# Altium project SAMC21_Xplained_Pro.PrjPCB (part 1 of 2)
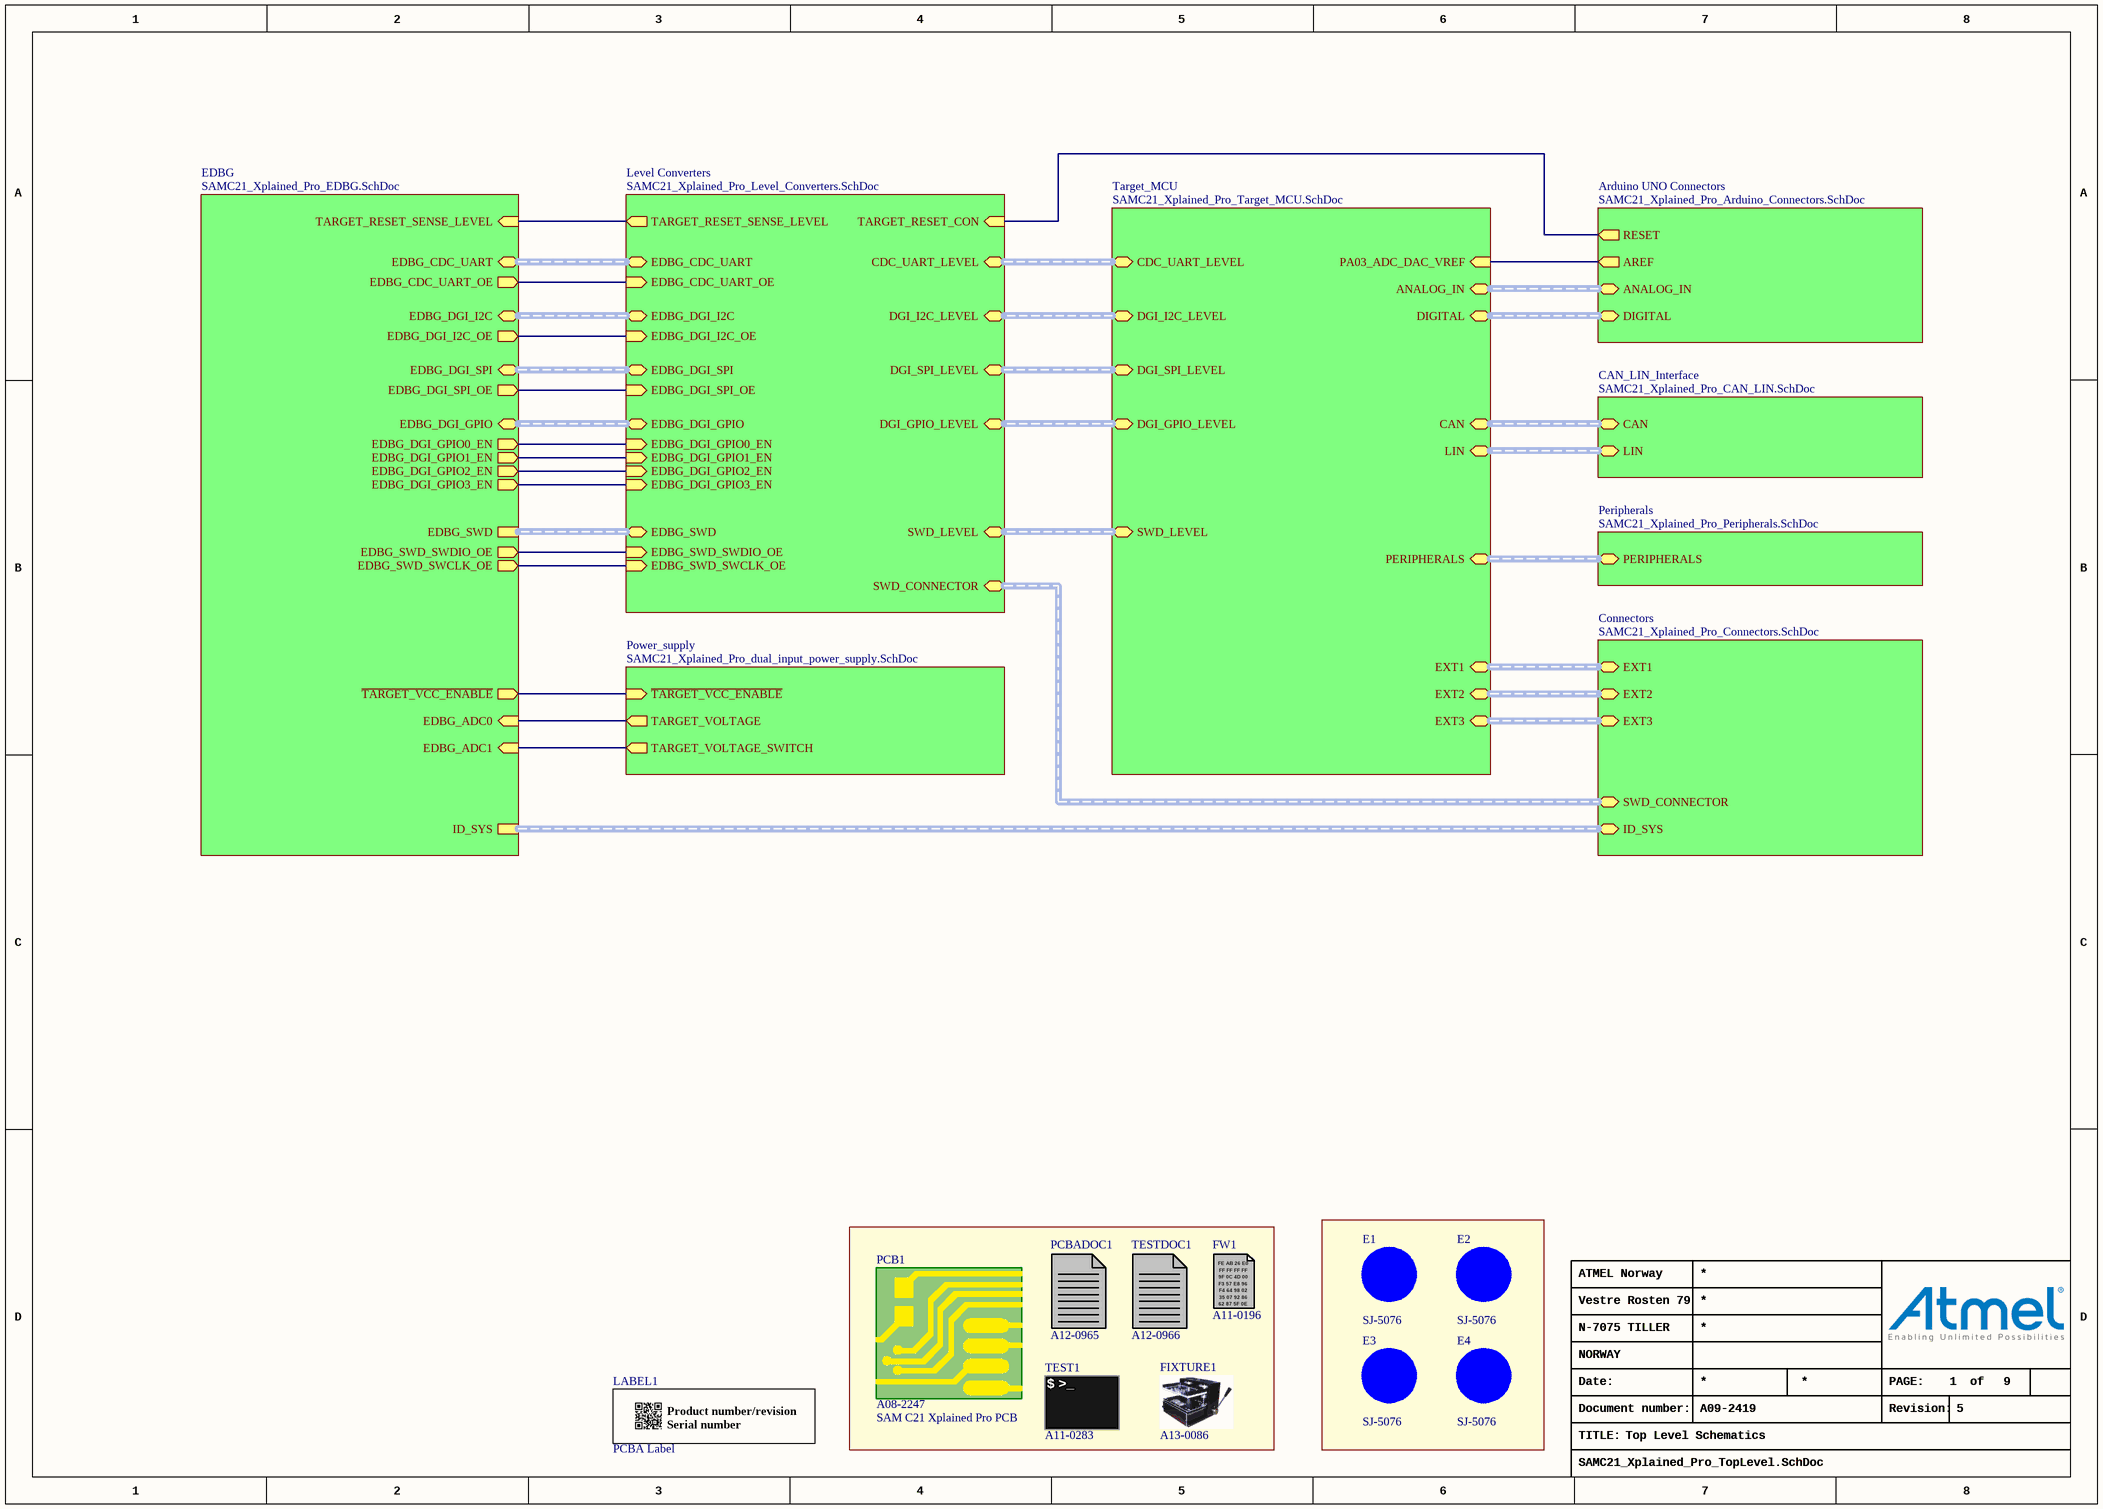
[diagram p0: SAMC21_Xplained_Pro_TopLevel.SchDoc]
9 sheets, 238 parts. Net scope: hierarchical (ports join the sheet entries above them; power ports are global).
Board file: SAMC21_Xplained_Pro.PcbDoc
Sheets:
  SAMC21_Xplained_Pro_TopLevel.SchDoc
    Target_MCU = SAMC21_Xplained_Pro_Target_MCU.SchDoc
    EDBG = SAMC21_Xplained_Pro_EDBG.SchDoc
    Connectors = SAMC21_Xplained_Pro_Connectors.SchDoc
    Power_supply = SAMC21_Xplained_Pro_dual_input_power_supply.SchDoc
    CAN_LIN_Interface = SAMC21_Xplained_Pro_CAN_LIN.SchDoc
    Arduino UNO Connectors = SAMC21_Xplained_Pro_Arduino_Connectors.SchDoc
    Level Converters = SAMC21_Xplained_Pro_Level_Converters.SchDoc
    Peripherals = SAMC21_Xplained_Pro_Peripherals.SchDoc

## Sheet SAMC21_Xplained_Pro_TopLevel.SchDoc: Top Level Schematics
size A3; Organization: ATMEL Norway; Address1: Vestre Rosten 79; Address2: N-7075 TILLER; Address3: NORWAY; DocumentNumber: A09-2419; Revision: 5; SheetNumber: 1; SheetTotal: 9; PageSetup: Record=PageOptions|CenterHorizontal=True|CenterVertical=True|PrintScale=1.01|XCorrection=1.00|YCorrection=1.00|PrintKind=1|BorderSize=5000000|LeftOffset=0|BottomOffset=0|Orientation=2|PaperLength=1000|PaperWidth=1000|Scale=100|PaperSource=7|PrintQuality=-4|MediaType=1|DitherType=10|PaperKind=Letter|PrintScaleMode=1

### Parts
E1  value SJ-5076  [AP8-00192]
E2  value SJ-5076  [AP8-00192]
E3  value SJ-5076  [AP8-00192]
E4  value SJ-5076  [AP8-00192]
FIXTURE1  AN: A13-0086  (mechanical)
FW1  AN: A11-0196  (mechanical)
LABEL1  value PCBA Label  [AP8-00317]
PCB1  value SAM C21 Xplained Pro PCB  AN: A08-2247  (mechanical)
PCBADOC1  AN: A12-0965  (mechanical)
TEST1  AN: A11-0283  (mechanical)
TESTDOC1  AN: A12-0966  (mechanical)

### Sub-sheets
Arduino UNO Connectors = SAMC21_Xplained_Pro_Arduino_Connectors.SchDoc: ANALOG_IN (harness ANALOG_IN), DIGITAL (harness DIGITAL1), RESET (out), AREF (out)
CAN_LIN_Interface = SAMC21_Xplained_Pro_CAN_LIN.SchDoc: CAN (harness CAN), LIN (harness LIN)
Connectors = SAMC21_Xplained_Pro_Connectors.SchDoc: ID_SYS (harness ID_SYS), EXT1 (harness EXT), EXT3 (harness EXT), EXT2 (harness EXT), SWD_CONNECTOR (harness SWD)
EDBG = SAMC21_Xplained_Pro_EDBG.SchDoc: ID_SYS (harness ID_SYS), EDBG_SWD (harness SWD), EDBG_CDC_UART (harness CDC_UART), EDBG_DGI_I2C (harness DGI_I2C), EDBG_DGI_SPI (harness DGI_SPI), EDBG_DGI_GPIO (harness DGI_GPIO), EDBG_ADC0 (in), ~{TARGET_VCC_ENABLE} (out), EDBG_CDC_UART_OE (out), EDBG_SWD_SWDIO_OE (out), EDBG_DGI_I2C_OE (out), EDBG_ADC1 (in), EDBG_SWD_SWCLK_OE (out), EDBG_DGI_SPI_OE (out), TARGET_RESET_SENSE_LEVEL (in), EDBG_DGI_GPIO0_EN (out), EDBG_DGI_GPIO1_EN (out), EDBG_DGI_GPIO2_EN (out), EDBG_DGI_GPIO3_EN (out)
Level Converters = SAMC21_Xplained_Pro_Level_Converters.SchDoc: EDBG_DGI_SPI (harness DGI_SPI), EDBG_DGI_I2C (harness DGI_I2C), EDBG_DGI_GPIO (harness DGI_GPIO), EDBG_CDC_UART (harness CDC_UART), EDBG_SWD (harness SWD), EDBG_SWD_SWDIO_OE (in), EDBG_SWD_SWCLK_OE (in), SWD_LEVEL (harness SWD), DGI_SPI_LEVEL (harness DGI_SPI), DGI_I2C_LEVEL (harness DGI_I2C), DGI_GPIO_LEVEL (harness DGI_GPIO), CDC_UART_LEVEL (harness CDC_UART), TARGET_RESET_SENSE_LEVEL (out), SWD_CONNECTOR (harness SWD), EDBG_DGI_GPIO0_EN (in), EDBG_DGI_GPIO1_EN (in), EDBG_DGI_GPIO2_EN (in), EDBG_DGI_GPIO3_EN (in), EDBG_CDC_UART_OE (in), EDBG_DGI_I2C_OE (in), EDBG_DGI_SPI_OE (in), TARGET_RESET_CON (in)
Peripherals = SAMC21_Xplained_Pro_Peripherals.SchDoc: PERIPHERALS (harness Peripherals)
Power_supply = SAMC21_Xplained_Pro_dual_input_power_supply.SchDoc: TARGET_VOLTAGE (out), ~{TARGET_VCC_ENABLE} (in), TARGET_VOLTAGE_SWITCH (out)
Target_MCU = SAMC21_Xplained_Pro_Target_MCU.SchDoc: SWD_LEVEL (harness SWD), DGI_SPI_LEVEL (harness DGI_SPI), DGI_I2C_LEVEL (harness DGI_I2C), DGI_GPIO_LEVEL (harness DGI_GPIO), CDC_UART_LEVEL (harness CDC_UART), EXT2 (harness EXT), EXT3 (harness EXT), EXT1 (harness EXT), CAN (harness CAN), LIN (harness LIN), DIGITAL (harness DIGITAL1), ANALOG_IN (harness ANALOG_IN), PA03_ADC_DAC_VREF (in), PERIPHERALS (harness Peripherals)

### Nets
EDBG_ADC0: sheet EDBG/EDBG_ADC0, sheet Power_supply/TARGET_VOLTAGE
EDBG_ADC1: sheet EDBG/EDBG_ADC1, sheet Power_supply/TARGET_VOLTAGE_SWITCH
EDBG_CDC_UART_OE: sheet EDBG/EDBG_CDC_UART_OE, sheet Level Converters/EDBG_CDC_UART_OE
EDBG_DGI_GPIO0_EN: sheet EDBG/EDBG_DGI_GPIO0_EN, sheet Level Converters/EDBG_DGI_GPIO0_EN
EDBG_DGI_GPIO1_EN: sheet EDBG/EDBG_DGI_GPIO1_EN, sheet Level Converters/EDBG_DGI_GPIO1_EN
EDBG_DGI_GPIO2_EN: sheet EDBG/EDBG_DGI_GPIO2_EN, sheet Level Converters/EDBG_DGI_GPIO2_EN
EDBG_DGI_GPIO3_EN: sheet EDBG/EDBG_DGI_GPIO3_EN, sheet Level Converters/EDBG_DGI_GPIO3_EN
EDBG_DGI_I2C_OE: sheet EDBG/EDBG_DGI_I2C_OE, sheet Level Converters/EDBG_DGI_I2C_OE
EDBG_DGI_SPI_OE: sheet EDBG/EDBG_DGI_SPI_OE, sheet Level Converters/EDBG_DGI_SPI_OE
EDBG_SWD_SWCLK_OE: sheet EDBG/EDBG_SWD_SWCLK_OE, sheet Level Converters/EDBG_SWD_SWCLK_OE
EDBG_SWD_SWDIO_OE: sheet EDBG/EDBG_SWD_SWDIO_OE, sheet Level Converters/EDBG_SWD_SWDIO_OE
PA03_ADC_DAC_VREF: sheet Target_MCU/PA03_ADC_DAC_VREF, sheet Arduino UNO Connectors/AREF
~{TARGET_VCC_ENABLE}: sheet EDBG/~{TARGET_VCC_ENABLE}, sheet Power_supply/~{TARGET_VCC_ENABLE}
TARGET_RESET_CON: sheet Arduino UNO Connectors/RESET, sheet Level Converters/TARGET_RESET_CON
TARGET_RESET_SENSE_LEVEL: sheet EDBG/TARGET_RESET_SENSE_LEVEL, sheet Level Converters/TARGET_RESET_SENSE_LEVEL

Not connected (* = marked no-connect by the designer): E1 1(FIDUCIAL); E2 1(FIDUCIAL); E3 1(FIDUCIAL); E4 1(FIDUCIAL)

### Buses and harness runs
harness sheet Arduino UNO Connectors/ANALOG_IN = sheet Target_MCU/ANALOG_IN
harness sheet Arduino UNO Connectors/DIGITAL = sheet Target_MCU/DIGITAL
harness sheet CAN_LIN_Interface/CAN = sheet Target_MCU/CAN
harness sheet CAN_LIN_Interface/LIN = sheet Target_MCU/LIN
harness sheet Connectors/EXT1 = sheet Target_MCU/EXT1
harness sheet Connectors/EXT2 = sheet Target_MCU/EXT2
harness sheet Connectors/EXT3 = sheet Target_MCU/EXT3
harness sheet Connectors/ID_SYS = sheet EDBG/ID_SYS
harness sheet Connectors/SWD_CONNECTOR = sheet Level Converters/SWD_CONNECTOR
harness sheet EDBG/EDBG_CDC_UART = sheet Level Converters/EDBG_CDC_UART
harness sheet EDBG/EDBG_DGI_GPIO = sheet Level Converters/EDBG_DGI_GPIO
harness sheet EDBG/EDBG_DGI_I2C = sheet Level Converters/EDBG_DGI_I2C
harness sheet EDBG/EDBG_DGI_SPI = sheet Level Converters/EDBG_DGI_SPI
harness sheet EDBG/EDBG_SWD = sheet Level Converters/EDBG_SWD
harness sheet Level Converters/CDC_UART_LEVEL = sheet Target_MCU/CDC_UART_LEVEL
harness sheet Level Converters/DGI_GPIO_LEVEL = sheet Target_MCU/DGI_GPIO_LEVEL
harness sheet Level Converters/DGI_I2C_LEVEL = sheet Target_MCU/DGI_I2C_LEVEL
harness sheet Level Converters/DGI_SPI_LEVEL = sheet Target_MCU/DGI_SPI_LEVEL
harness sheet Level Converters/SWD_LEVEL = sheet Target_MCU/SWD_LEVEL
harness sheet Peripherals/PERIPHERALS = sheet Target_MCU/PERIPHERALS

### Notes on the sheet
- Date:
- PAGE:
- of
- TITLE:
- Document number:
- Revision:
- (in symbol A09-0611) / Product number/revision / Serial number
- (in symbol A11-0196) FE AB 26 E0; FF FF FF FF; 9F 0C 4D 00; F3 57 E8 96; F4 64 98 02; 35 07 92 86; 62 87 5F 0E
- (in symbol A11-0283) $ >_

### Library data of the parts
E1-E4 = A08-0053: 2.8mm adhesive feet,diam 8.0mm; PartGroup: Mechanical devices,Mounting accessories; Manufacturer: 3M; AN: A08-0053; Height: 2,79999995231628; MPN: SJ-5076
FIXTURE1 = A13-0086: Xplained PRO MCU board Jupiter Test Fixture; PartGroup: Test Equipment,Test Fixtures; Manufacturer: ESCATEC; Value: Xplained PRO MCU board Jupiter Test Fixture; MPN: Xplained PRO MCU board Jupiter Test Fixture
FW1 = A11-0196: EDBG secured firmware; PartGroup: Software,Firmware,Tools; Value: EDBG secured firmware
LABEL1 = A09-0611: PCBA identification label PP Top White Gloss; PartGroup: Mechanical devices,Packaging materials,Printed Labels; Manufacturer: ACT Logimark AS; MPN: 505462; AN: A09-0611
PCB1 = A08-2247: SAM C21 Xplained Pro PCB, 4 layer, 60mm x 100mm; PartGroup: Mechanical devices,Printed circuit boards
PCBADOC1 = A12-0965: SAM C21 Xplained Pro PCBA documentation; PartGroup: Documentation,PCBA Documents,Atmel; Value: A09-2419 PCBA Files
TEST1 = A11-0283: Fixture eggTest for SAM C21 Xplained Pro; PartGroup: Software,Test software,Starter Kit; Value: SAM C21 Xplained Pro test
TESTDOC1 = A12-0966: SAM C21 Xplained Pro Test Instructions; PartGroup: Documentation,Procedures,Test Instructions; Value: SAM C21 Xplained Pro Test Instructions

## Sheet SAMC21_Xplained_Pro_Target_MCU.SchDoc: Target MCU
size A3; Organization: ATMEL Norway; Address1: Vestre Rosten 79; Address2: N-7075 TILLER; Address3: NORWAY; DocumentNumber: A09-2419; Revision: 5; SheetNumber: 4; SheetTotal: 9; PageSetup: Record=PageOptions|CenterHorizontal=True|CenterVertical=True|PrintScale=1.01|XCorrection=1.00|YCorrection=1.00|PrintKind=0|BorderSize=5000000|LeftOffset=0|BottomOffset=0|Orientation=2|PaperLength=1000|PaperWidth=1000|Scale=100|PaperSource=15|PrintQuality=-3|MediaType=1|DitherType=10|PrintScaleMode=1|PaperKind=A3|PaperIndex=8
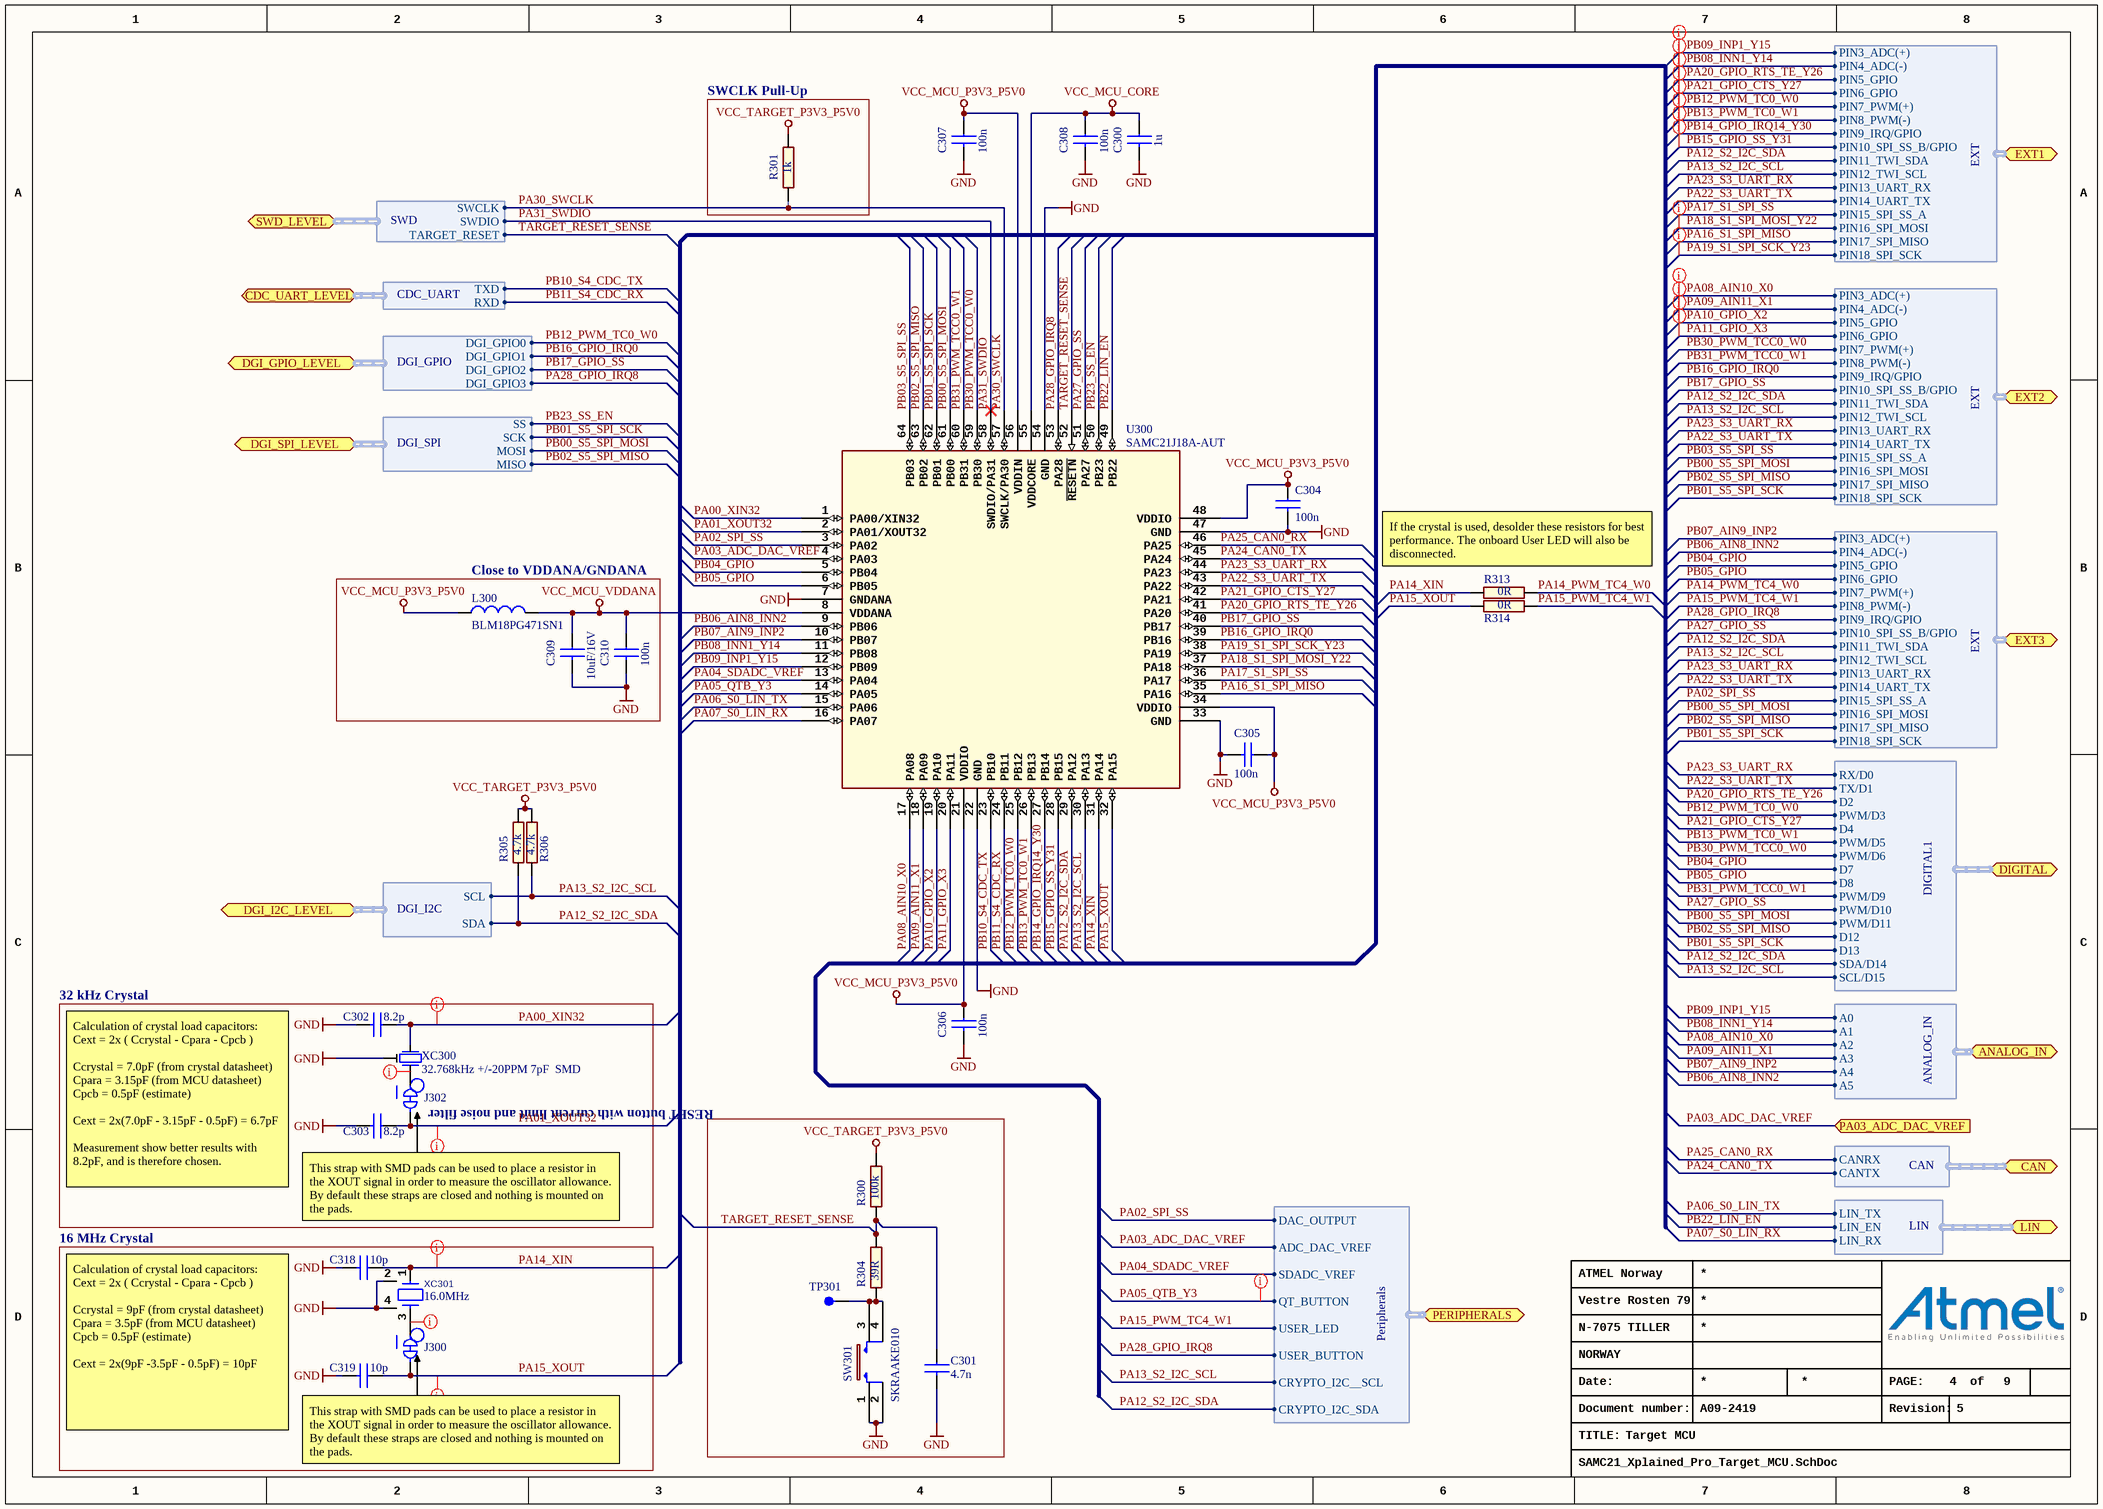
[diagram p1: SAMC21_Xplained_Pro_Target_MCU.SchDoc]

### Parts
C300  value 1u  [AP1-00001]
C301  value 4.7n  [AP1-00001]
C302  value 8.2p  [AP1-00001]
C303  value 8.2p  [AP1-00001]
C304  value 100n  [AP1-00001]
C305  value 100n  [AP1-00001]
C306  value 100n  [AP1-00001]
C307  value 100n  [AP1-00001]
C308  value 100n  [AP1-00001]
C309  value 10uF/16V  [AP1-00039]
C310  value 100n  [AP1-00001]
C318  value 10p  [AP1-00001]
C319  value 10p  [AP1-00001]
J300  (no value)  [AP9-00044]  (net tie, no BOM)
J302  (no value)  [AP9-00044]  (net tie, no BOM)
L300  value BLM18PG471SN1  [AP3-00005]
R300  value 100k  [AP2-00011]
R301  value 1k  [AP2-00000]
R304  value 39R  [AP2-00011]
R305  value 4.7k  [AP2-00000]
R306  value 4.7k  [AP2-00000]
R313  value 0R  [AP2-00000]
R314  value 0R  [AP2-00000]
SW301  value SKRAAKE010  [AP8-00137]  (hidden comment: same as A08-0091 but less force is needed; Can be ordered in low volumes from Mouser)
TP301  (no value)  [AP8-00010]  (no BOM)
U300  value SAMC21J18A-AUT  [AP6-00173]
XC300  value 32.768kHz +/-20PPM 7pF  SMD  [AP7-00044]  (hidden comment: Farnell order no:1539364)
XC301  value 16.0MHz  [AP7-00061]

### Blocks framed on the sheet
SWCLK Pull-Up: R301
Close to VDDANA/GNDANA: C309 C310 L300
32 kHz Crystal: C302 C303 J302 XC300
RESET button with current limit and noise filter: C301 R300 R304 SW301 TP301
16 MHz Crystal: C318 C319 J300 XC301

### Ports
ANALOG_IN (harness ANALOG_IN), CAN (harness CAN), CDC_UART_LEVEL (harness CDC_UART), DGI_GPIO_LEVEL (harness DGI_GPIO), DGI_I2C_LEVEL (harness DGI_I2C), DGI_SPI_LEVEL (harness DGI_SPI), DIGITAL (harness DIGITAL1), EXT1 (harness EXT), EXT2 (harness EXT), EXT3 (harness EXT), LIN (harness LIN), PA03_ADC_DAC_VREF (in), PERIPHERALS (harness Peripherals), SWD_LEVEL (harness SWD)

### Harnesses
SWD: SWCLK, SWDIO, TARGET_RESET
DGI_GPIO: DGI_GPIO0, DGI_GPIO1, DGI_GPIO2, DGI_GPIO3
DGI_SPI: MISO, MOSI, SCK, SS
DGI_I2C: SCL, SDA
CDC_UART: RXD, TXD
EXT: PIN10_SPI_SS_B/GPIO, PIN11_TWI_SDA, PIN12_TWI_SCL, PIN13_UART_RX, PIN14_UART_TX, PIN15_SPI_SS_A, PIN16_SPI_MOSI, PIN17_SPI_MISO, PIN18_SPI_SCK, PIN3_ADC(+), PIN4_ADC(-), PIN5_GPIO, PIN6_GPIO, PIN7_PWM(+), PIN8_PWM(-), PIN9_IRQ/GPIO
DIGITAL1: RX/D0, TX/D1, D2, PWM/D3, D4, PWM/D5, PWM/D6, D7, D8, PWM/D9, PWM/D10, PWM/D11, D12, D13, SDA/D14, SCL/D15
ANALOG_IN: A0, A1, A2, A3, A4, A5
CAN: CANTX, CANRX
LIN: LIN_RX, LIN_EN, LIN_TX
Peripherals: DAC_OUTPUT, ADC_DAC_VREF, SDADC_VREF, QT_BUTTON, USER_LED, USER_BUTTON, CRYPTO_I2C__SCL, CRYPTO_I2C_SDA

### Nets
GND: C300.2 C301.2 C302.2 C303.2 C304.2 C305.2 C306.2 C307.2 C308.2 C309.2 C310.2 C318.2 C319.2 SW301.1 SW301.2 U300.7(GNDANA) U300.22(GND) U300.33(GND) U300.47(GND) U300.54(GND) XC300.3 XC301.2(GND) XC301.4(GND)
VCC_MCU_CORE: C300.1 C308.1 U300.55(VDDCORE)
VCC_MCU_P3V3_P5V0: C304.1 C305.1 C306.1 C307.1 L300.1 U300.21(VDDIO) U300.34(VDDIO) U300.48(VDDIO) U300.56(VDDIN)
VCC_MCU_VDDANA: C309.1 C310.1 L300.2 U300.8(VDDANA)
VCC_TARGET_P3V3_P5V0: R300.2 R301.2 R305.2 R306.2
PA00_XIN32: C302.1 U300.1(PA00/XIN32) XC300.2
PA01_XOUT32: C303.1 J302.2 U300.2(PA01/XOUT32)
PA02_SPI_SS: U300.3(PA02) ; port EXT3.PIN15_SPI_SS_A, port PERIPHERALS.DAC_OUTPUT
PA03_ADC_DAC_VREF: U300.4(PA03) ; port PA03_ADC_DAC_VREF, port PERIPHERALS.ADC_DAC_VREF
PA04_SDADC_VREF: U300.13(PA04) ; port PERIPHERALS.SDADC_VREF
PA05_QTB_Y3: U300.14(PA05) ; port PERIPHERALS.QT_BUTTON
PA06_S0_LIN_TX: U300.15(PA06) ; port LIN.LIN_TX
PA07_S0_LIN_RX: U300.16(PA07) ; port LIN.LIN_RX
PA08_AIN10_X0: U300.17(PA08) ; port EXT2.PIN3_ADC(+), port ANALOG_IN.A2
PA09_AIN11_X1: U300.18(PA09) ; port EXT2.PIN4_ADC(-), port ANALOG_IN.A3
PA10_GPIO_X2: U300.19(PA10) ; port EXT2.PIN5_GPIO
PA11_GPIO_X3: U300.20(PA11) ; port EXT2.PIN6_GPIO
PA12_S2_I2C_SDA: R305.1 U300.29(PA12) ; port DGI_I2C_LEVEL.SDA, port EXT1.PIN11_TWI_SDA, port EXT2.PIN11_TWI_SDA, port EXT3.PIN11_TWI_SDA, port DIGITAL.SDA/D14, port PERIPHERALS.CRYPTO_I2C_SDA
PA13_S2_I2C_SCL: R306.1 U300.30(PA13) ; port DGI_I2C_LEVEL.SCL, port EXT1.PIN12_TWI_SCL, port EXT2.PIN12_TWI_SCL, port EXT3.PIN12_TWI_SCL, port DIGITAL.SCL/D15, port PERIPHERALS.CRYPTO_I2C__SCL
PA14_PWM_TC4_W0: R313.2 ; port EXT3.PIN7_PWM(+)
PA14_XIN: C318.1 R313.1 U300.31(PA14) XC301.1(IN)
PA15_PWM_TC4_W1: R314.2 ; port EXT3.PIN8_PWM(-), port PERIPHERALS.USER_LED
PA15_XOUT: C319.1 J300.2 R314.1 U300.32(PA15)
PA16_S1_SPI_MISO: U300.35(PA16) ; port EXT1.PIN17_SPI_MISO
PA17_S1_SPI_SS: U300.36(PA17) ; port EXT1.PIN15_SPI_SS_A
PA18_S1_SPI_MOSI_Y22: U300.37(PA18) ; port EXT1.PIN16_SPI_MOSI
PA19_S1_SPI_SCK_Y23: U300.38(PA19) ; port EXT1.PIN18_SPI_SCK
PA20_GPIO_RTS_TE_Y26: U300.41(PA20) ; port EXT1.PIN5_GPIO, port DIGITAL.D2
PA21_GPIO_CTS_Y27: U300.42(PA21) ; port EXT1.PIN6_GPIO, port DIGITAL.D4
PA22_S3_UART_TX: U300.43(PA22) ; port EXT1.PIN14_UART_TX, port EXT2.PIN14_UART_TX, port EXT3.PIN14_UART_TX, port DIGITAL.TX/D1
PA23_S3_UART_RX: U300.44(PA23) ; port EXT1.PIN13_UART_RX, port EXT2.PIN13_UART_RX, port EXT3.PIN13_UART_RX, port DIGITAL.RX/D0
PA24_CAN0_TX: U300.45(PA24) ; port CAN.CANTX
PA25_CAN0_RX: U300.46(PA25) ; port CAN.CANRX
PA27_GPIO_SS: U300.51(PA27) ; port EXT3.PIN10_SPI_SS_B/GPIO, port DIGITAL.PWM/D10
PA28_GPIO_IRQ8: U300.53(PA28) ; port DGI_GPIO_LEVEL.DGI_GPIO3, port EXT3.PIN9_IRQ/GPIO, port PERIPHERALS.USER_BUTTON
PA30_SWCLK: R301.1 U300.57(SWCLK/PA30) ; port SWD_LEVEL.SWCLK
PA31_SWDIO: U300.58(SWDIO/PA31) ; port SWD_LEVEL.SWDIO
PB00_S5_SPI_MOSI: U300.61(PB00) ; port DGI_SPI_LEVEL.MOSI, port EXT2.PIN16_SPI_MOSI, port EXT3.PIN16_SPI_MOSI, port DIGITAL.PWM/D11
PB01_S5_SPI_SCK: U300.62(PB01) ; port DGI_SPI_LEVEL.SCK, port EXT2.PIN18_SPI_SCK, port EXT3.PIN18_SPI_SCK, port DIGITAL.D13
PB02_S5_SPI_MISO: U300.63(PB02) ; port DGI_SPI_LEVEL.MISO, port EXT2.PIN17_SPI_MISO, port EXT3.PIN17_SPI_MISO, port DIGITAL.D12
PB03_S5_SPI_SS: U300.64(PB03) ; port EXT2.PIN15_SPI_SS_A
PB04_GPIO: U300.5(PB04) ; port EXT3.PIN5_GPIO, port DIGITAL.D7
PB05_GPIO: U300.6(PB05) ; port EXT3.PIN6_GPIO, port DIGITAL.D8
PB06_AIN8_INN2: U300.9(PB06) ; port EXT3.PIN4_ADC(-), port ANALOG_IN.A5
PB07_AIN9_INP2: U300.10(PB07) ; port EXT3.PIN3_ADC(+), port ANALOG_IN.A4
PB08_INN1_Y14: U300.11(PB08) ; port EXT1.PIN4_ADC(-), port ANALOG_IN.A1
PB09_INP1_Y15: U300.12(PB09) ; port EXT1.PIN3_ADC(+), port ANALOG_IN.A0
PB10_S4_CDC_TX: U300.23(PB10) ; port CDC_UART_LEVEL.TXD
PB11_S4_CDC_RX: U300.24(PB11) ; port CDC_UART_LEVEL.RXD
PB12_PWM_TC0_W0: U300.25(PB12) ; port DGI_GPIO_LEVEL.DGI_GPIO0, port EXT1.PIN7_PWM(+), port DIGITAL.PWM/D3
PB13_PWM_TC0_W1: U300.26(PB13) ; port EXT1.PIN8_PWM(-), port DIGITAL.PWM/D5
PB14_GPIO_IRQ14_Y30: U300.27(PB14) ; port EXT1.PIN9_IRQ/GPIO
PB15_GPIO_SS_Y31: U300.28(PB15) ; port EXT1.PIN10_SPI_SS_B/GPIO
PB16_GPIO_IRQ0: U300.39(PB16) ; port DGI_GPIO_LEVEL.DGI_GPIO1, port EXT2.PIN9_IRQ/GPIO
PB17_GPIO_SS: U300.40(PB17) ; port DGI_GPIO_LEVEL.DGI_GPIO2, port EXT2.PIN10_SPI_SS_B/GPIO
PB22_LIN_EN: U300.49(PB22) ; port LIN.LIN_EN
PB23_SS_EN: U300.50(PB23) ; port DGI_SPI_LEVEL.SS
PB30_PWM_TCC0_W0: U300.59(PB30) ; port EXT2.PIN7_PWM(+), port DIGITAL.PWM/D6
PB31_PWM_TCC0_W1: U300.60(PB31) ; port EXT2.PIN8_PWM(-), port DIGITAL.PWM/D9
TARGET_RESET_SENSE: C301.1 R300.1 R304.2 U300.52(~{RESETN}) ; port SWD_LEVEL.TARGET_RESET
NetJ300_1: J300.1 XC301.3(OUT)
NetJ302_1: J302.1 XC300.1
NetR304_1: R304.1 SW301.3 SW301.4 TP301.1

### Layout directives
rule Assembly Testpoint Usage [Testpoint - Not Allowed    Multiple - Not Allowed]: NetJ300_1, NetJ302_1, PA00_XIN32, PA01_XOUT32, PA14_XIN, PA15_XOUT
net class TOUCH; rule Clearance Constraint [Clearance = 0.6mm]: PA05_QTB_Y3, PA08_AIN10_X0, PA09_AIN11_X1, PA10_GPIO_X2, PA11_GPIO_X3, PA18_S1_SPI_MOSI_Y22, PA19_S1_SPI_SCK_Y23, PA20_GPIO_RTS_TE_Y26, PA21_GPIO_CTS_Y27, PB08_INN1_Y14, PB09_INP1_Y15, PB12_PWM_TC0_W0, PB13_PWM_TC0_W1, PB14_GPIO_IRQ14_Y30, PB15_GPIO_SS_Y31

### Notes on the sheet
- If the crystal is used, desolder these resistors for best performance. The onboard User LED will also be disconnected.
- Calculation of crystal load capacitors:
  Cext = 2x ( Ccrystal - Cpara - Cpcb )
  Ccrystal = 7.0pF (from crystal datasheet)
  Cpara = 3.15pF (from MCU datasheet)
  Cpcb = 0.5pF (estimate)
  Cext = 2x(7.0pF - 3.15pF - 0.5pF) = 6.7pF
  Measurement show better results with 8.2pF, and is therefore chosen.
- This strap with SMD pads can be used to place a resistor in the XOUT signal in order to measure the oscillator allowance.
  By default these straps are closed and nothing is mounted on the pads.
- Calculation of crystal load capacitors:
  Cext = 2x ( Ccrystal - Cpara - Cpcb )
  Ccrystal = 9pF (from crystal datasheet)
  Cpara = 3.5pF (from MCU datasheet)
  Cpcb = 0.5pF (estimate)
  Cext = 2x(9pF -3.5pF - 0.5pF) = 10pF
- Date:
- PAGE:
- of
- TITLE:
- Document number:
- Revision:

### Library data of the parts
C300 = A01-0286: Ceramic capacitor, SMD 0402, X5R, 6.3V, +/-10% (de26942); PartGroup: Capacitors,Ceramic,SMD 0402; Manufacturer: Kemet; MPN: C0402C105K9PAC; TemperatureRange: -55 to 85 deg C; AN: A01-0286; Tolerance: +/-10%; Height: 0,5
C301 = A01-0046: Ceramic capacitor, SMD 0402, X7R, 25V, +/-10% (de35287); PartGroup: Capacitors,Ceramic,SMD 0402; TemperatureRange: -55 - +125 deg C; AN: A01-0046; Tolerance: 25V, +/-10%; Height: 0,550000011920929
C302 C303 = A01-0014: Ceramic capacitor, SMD 0402, NP0, 50V, +/-5%; PartGroup: Capacitors,Ceramic,SMD 0402; TemperatureRange: -55 - +125 deg C; AN: A01-0014; Tolerance: 50V, +/-5%; Height: 0,550000011920929
C304-C308 C310 = A01-0246: Ceramic capacitor, SMD 0402, X7R, 16V, +/-10%; PartGroup: Capacitors,Ceramic,SMD 0402; Manufacturer: Kemet; MPN: C0402C104K4RACTU; TemperatureRange: -55 - +125 deg C; AN: A01-0246; Tolerance: 16V, +/-10%; Height: 0,5
C309 = A01-0491: Ceramic capacitor, SMD 0603, X5R, 16V, 10UF ± 20% (High Density); PartGroup: Capacitors,Ceramic,SMD 0603; Manufacturer: Taiyo Yuden; MPN: EMK107BBJ106MA-T; TemperatureRange: -55°C to +85°C; Tolerance: ­± 20%; AN: A01-0491; Height: 0,819999992847443
C318 C319 = A01-0015: Ceramic capacitor, SMD 0402, NP0, 50V, +/-5%; PartGroup: Capacitors,Ceramic,SMD 0402; TemperatureRange: -55 - +125 deg C; AN: A01-0015; Tolerance: 50V, +/-5%; Height: 0,550000011920929
J300 J302 = A09-0783: Default closed SMD strap, 0603 size; PartGroup: Mechanical devices,PCB implemented components; Value: SMD-STRAP_0603_CLOSED; AN: A09-0783; Height: 0
L300 = A03-0035: SMD RF inductor 0603. Z=470Ohm (@100MHz), Max R(dc)=0.65Ohm, Max current=1A; PartGroup: Inductors,EMI; Manufacturer: Murata; Tolerance: ±25%; TemperatureRange: -55°C to +125°C; AN: A03-0035; Height: 0,800000011920929; MPN: BLM18PG471SN1
R300 = A02-0260: Thick film resistor, SMD 0402, 1/16W, 1%; PartGroup: Resistors,SMD,0402 1%; TemperatureRange: -55ï¿½ to +125ï¿½C; AN: A02-0260; Tolerance: 1 %; Height: 0,349999994039536
R301 = A02-0212: Thick film resistor, SMD 0402, 1/16W, 1%; PartGroup: Resistors,SMD,0402 1%; TemperatureRange: -55 - +125 deg C; AN: A02-0212; Tolerance: 1 %; Height: 0,349999994039536
R304 = A02-0178: Thick film resistor, SMD 0402, 1/16W, 1%; PartGroup: Resistors,SMD,0402 1%; TemperatureRange: -55 - +125 deg C; AN: A02-0178; Tolerance: 1 %; Height: 0,349999994039536
R305 R306 = A02-0228: Thick film resistor, SMD 0402, 1/16W, 1%; PartGroup: Resistors,SMD,0402 1%; TemperatureRange: -55ï¿½ to +125ï¿½C; AN: A02-0228; Tolerance: 1 %; Height: 0,349999994039536
R313 R314 = A02-0163: Thick film resistor, SMD 0402, 1/16W, 1%; PartGroup: Resistors,SMD,0402 1%; Manufacturer: (n/a); MPN: RMCF0402ZT0R00; TemperatureRange: -55 - +125 deg C; AN: A02-0163; Tolerance: 1 %; Height: 0,349999994039536
SW301 = A08-0790: 6.2x6.2 mm SMD tact switch, same as A08-0091 but less force is needed; PartGroup: Mechanical devices,Switches,SMD; Manufacturer: ALPS; TemperatureRange: -30 - +90 deg C; AN: A08-0790; Height: 5,09999990463257; MPN: SKRAAKE010
TP301 = A08-0004: Single SMD testpad; PartGroup: Mechanical devices,Connectors,Test points; AN: A08-0004; Value: TESTPAD; Height: 0
U300 = A06-1192: Atmel 32-bit RISC MCU 64pin; PartGroup: Integrated Circuits,MCU, MPU, DSP,ARM MCU; TemperatureRange: -40Â°C to +105Â°C; Design comment: *; AN: A06-1192; Height: 1,20000004768372; Manufacturer: ATMEL; MPN: SAMC21J18A-AUT
XC300 = A07-0052: 32k768 crystal, +-20ppm, CL=7pF, max ESR 60kOhm, SMD; PartGroup: Frequency devices,Crystals,SMD; Manufacturer: Micro Crystal; MPN: MS1V-T1K 32.768kHz 7pF +/-20PPM TA; Tolerance: +/- 20 PPM; TemperatureRange: -40 /+85; AN: A07-0052; Height: 2,07999992370605
XC301 = A07-0078: 16MHz uXtal, 3.2 x 2.5 mm SMD, CL=9pF, 15PPM, ESR=80ohm(Max.; PartGroup: Frequency devices,Crystals,SMD; Manufacturer: Epson Toyocom; MPN: TSX-3225 16.0000MF09Z-AC3; TemperatureRange: -40Â°C to +85Â°C; AN: A07-0078; Tolerance: 15ppm; Height: 0,699999988079071

## Sheet SAMC21_Xplained_Pro_EDBG.SchDoc: Embedded Debugger (EDBG)
size A3; Organization: ATMEL Norway; Address1: Vestre Rosten 79; Address2: N-7075 TILLER; Address3: NORWAY; DocumentNumber: A09-2419; Revision: 5; SheetNumber: 5; SheetTotal: 9; PageSetup: Record=PageOptions|CenterHorizontal=True|CenterVertical=True|PrintScale=0.71|XCorrection=1.00|YCorrection=1.00|PrintKind=0|BorderSize=5000000|LeftOffset=0|BottomOffset=0|Orientation=2|PaperLength=1000|PaperWidth=1000|Scale=100|PaperSource=15|PrintQuality=600|MediaType=1|DitherType=10|PrintScaleMode=1|PaperKind=A4 (210 x 297 mm)|PaperIndex=9
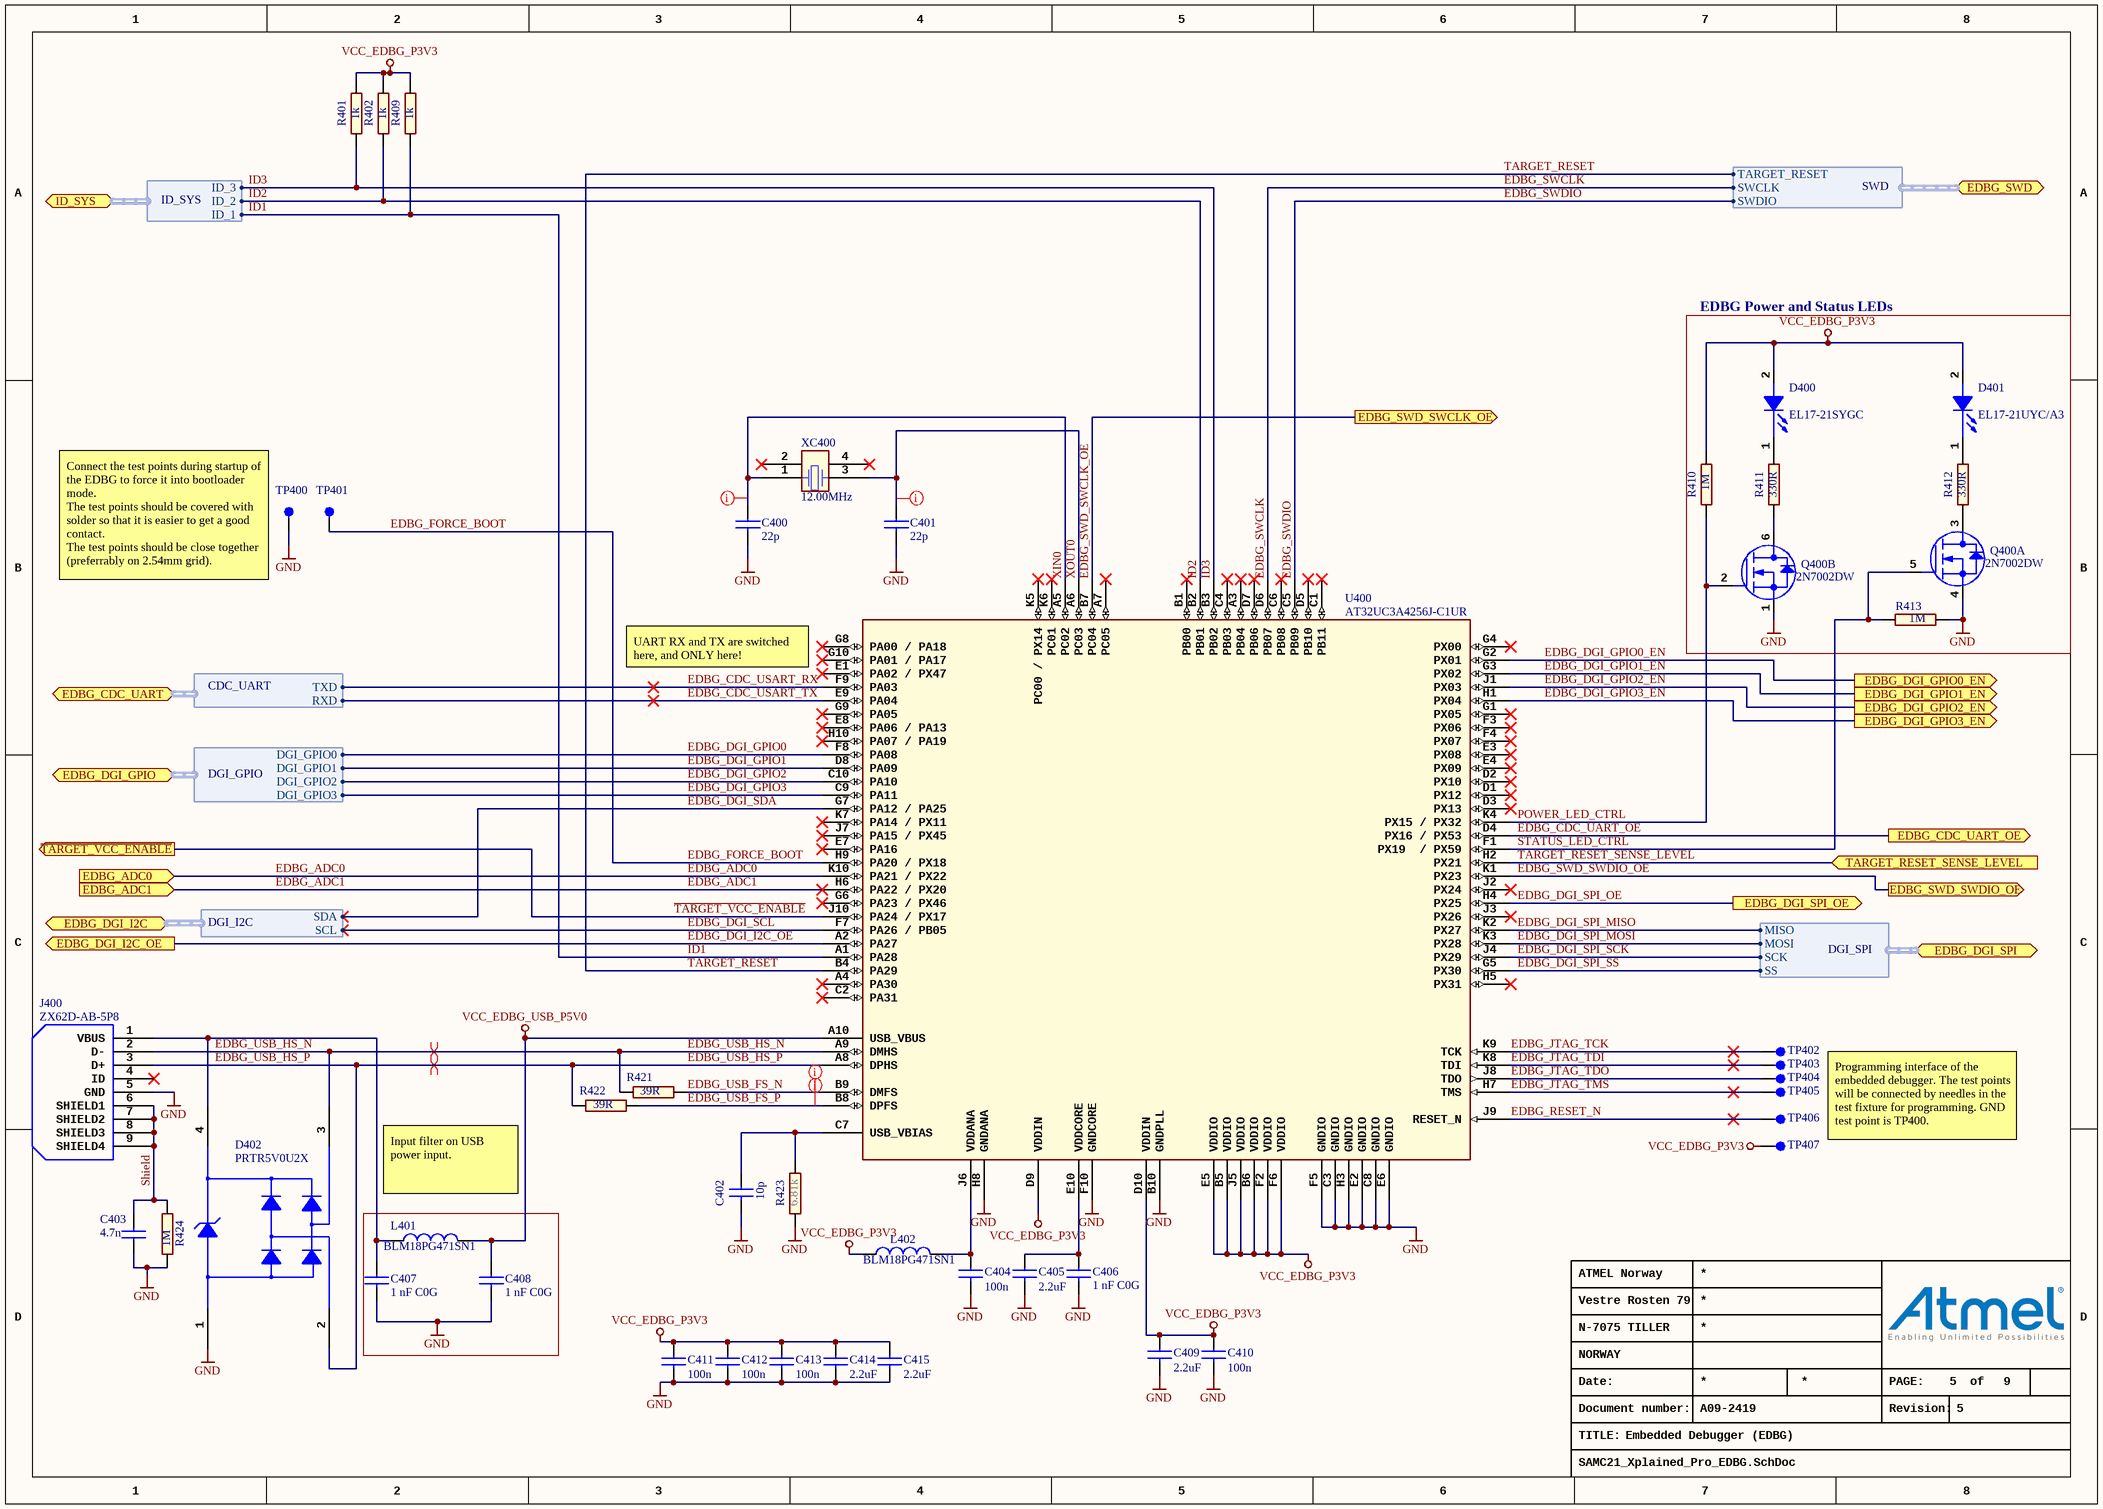
[diagram p2: SAMC21_Xplained_Pro_EDBG.SchDoc]

### Parts
C400  value 22p  [AP1-00053]
C401  value 22p  [AP1-00053]
C402  value 10p  [AP1-00053]
C403  value 4.7n  [AP1-00053]
C404  value 100n  [AP1-00053]
C405  value 2.2uF  [AP1-00053]  (hidden comment: Farnell no: 1288200)
C406  value 1 nF C0G  [AP1-00053]
C407  value 1 nF C0G  [AP1-00053]
C408  value 1 nF C0G  [AP1-00053]
C409  value 2.2uF  [AP1-00053]  (hidden comment: Farnell no: 1288200)
C410  value 100n  [AP1-00053]
C411  value 100n  [AP1-00053]
C412  value 100n  [AP1-00053]
C413  value 100n  [AP1-00053]
C414  value 2.2uF  [AP1-00053]  (hidden comment: Farnell no: 1288200)
C415  value 2.2uF  [AP1-00053]  (hidden comment: Farnell no: 1288200)
D400  value EL17-21SYGC  [AP4-00013]
D401  value EL17-21UYC/A3  [AP4-00013]
D402  value PRTR5V0U2X  [AP4-00001]  (hidden comment: Changed manufacturer from Philips to NXP.)
J400  value ZX62D-AB-5P8  [AP8-00852]  (hidden comment: 2,000 pieces per reel)
L401  value BLM18PG471SN1  [AP3-00005]
L402  value BLM18PG471SN1  [AP3-00005]
Q400  value 2N7002DW  [AP5-00001]  (hidden comment: Same as 2N7002 but with two MOSFETs in one package)  (parts A,B of 2)
R401  value 1k  [AP2-00000]
R402  value 1k  [AP2-00000]
R409  value 1k  [AP2-00000]
R410  value 1M  [AP2-00000]
R411  value 330R  [AP2-00000]
R412  value 330R  [AP2-00000]
R413  value 1M  [AP2-00000]
R421  value 39R  [AP2-00011]
R422  value 39R  [AP2-00011]
R423  value 6.81k  [AP2-00011]
R424  value 1M  [AP2-00011]
TP400  (no value)  [AP8-00010]  (no BOM)
TP401  (no value)  [AP8-00010]  (no BOM)
TP402  (no value)  [AP8-00010]  (no BOM)
TP403  (no value)  [AP8-00010]  (no BOM)
TP404  (no value)  [AP8-00010]  (no BOM)
TP405  (no value)  [AP8-00010]  (no BOM)
TP406  (no value)  [AP8-00010]  (no BOM)
TP407  (no value)  [AP8-00010]  (no BOM)
U400  value AT32UC3A4256J-C1UR  [AP6-00206]  (hidden comment: 100 ball VFBGA)
XC400  value 12.00MHz  [AP7-00039]

### Blocks framed on the sheet
EDBG Power and Status LEDs: D400 D401 Q400 R410-R413

### Ports
EDBG_ADC0 (in), EDBG_ADC1 (in), EDBG_CDC_UART (harness CDC_UART), EDBG_CDC_UART_OE (out), EDBG_DGI_GPIO0_EN (out), EDBG_DGI_GPIO1_EN (out), EDBG_DGI_GPIO2_EN (out), EDBG_DGI_GPIO3_EN (out), EDBG_DGI_GPIO (harness DGI_GPIO), EDBG_DGI_I2C (harness DGI_I2C), EDBG_DGI_I2C_OE (out), EDBG_DGI_SPI (harness DGI_SPI), EDBG_DGI_SPI_OE (out), EDBG_SWD (harness SWD), EDBG_SWD_SWCLK_OE (out), EDBG_SWD_SWDIO_OE (out), ID_SYS (harness ID_SYS), TARGET_RESET_SENSE_LEVEL (in), ~{TARGET_VCC_ENABLE} (out)

### Harnesses
CDC_UART: TXD, RXD
DGI_SPI: MISO, MOSI, SCK, SS
DGI_GPIO: DGI_GPIO0, DGI_GPIO1, DGI_GPIO2, DGI_GPIO3
ID_SYS: ID_1, ID_2, ID_3
SWD: SWCLK, SWDIO, TARGET_RESET
DGI_I2C: SCL, SDA

### Nets
GND: C400.2 C401.2 C402.2 C403.1 C404.2 C405.2 C406.2 C407.2 C408.2 C409.2 C410.2 C411.2 C412.2 C413.2 C414.2 C415.2 D402.1(GND) J400.5(GND) Q400.1(S2) Q400.4(S1) R413.1 R423.1 R424.1 TP400.1 U400.B10(GNDPLL) U400.C3(GNDIO) U400.C8(GNDIO) U400.E2(GNDIO) U400.E6(GNDIO) U400.F5(GNDIO) U400.F10(GNDCORE) U400.H3(GNDIO) U400.H8(GNDANA)
VCC_EDBG_P3V3: C409.1 C410.1 C411.1 C412.1 C413.1 C414.1 C415.1 D400.2(ANODE) D401.2(ANODE) L402.1 R401.2 R402.2 R409.2 R410.2 TP407.1 U400.B5(VDDIO) U400.B6(VDDIO) U400.D9(VDDIN) U400.D10(VDDIN) U400.E5(VDDIO) U400.F2(VDDIO) U400.F6(VDDIO) U400.J5(VDDIO)
VCC_EDBG_USB_P5V0: C408.1 L401.2 U400.A10(USB_VBUS)
EDBG_ADC0: U400.K10(PA21_/_PX22) ; port EDBG_ADC0
EDBG_ADC1: U400.H6(PA22_/_PX20) ; port EDBG_ADC1
EDBG_CDC_UART_OE: U400.D4(PX16_/_PX53) ; port EDBG_CDC_UART_OE
EDBG_CDC_USART_RX: U400.F9(PA03) ; port EDBG_CDC_UART.TXD  [project net EDBG_CDC_UART_TX]
EDBG_CDC_USART_TX: U400.E9(PA04) ; port EDBG_CDC_UART.RXD  [project net EDBG_CDC_UART_RX]
EDBG_DGI_GPIO0: U400.F8(PA08) ; port EDBG_DGI_GPIO.DGI_GPIO0
EDBG_DGI_GPIO0_EN: U400.G2(PX01) ; port EDBG_DGI_GPIO0_EN
EDBG_DGI_GPIO1: U400.D8(PA09) ; port EDBG_DGI_GPIO.DGI_GPIO1
EDBG_DGI_GPIO1_EN: U400.G3(PX02) ; port EDBG_DGI_GPIO1_EN
EDBG_DGI_GPIO2: U400.C10(PA10) ; port EDBG_DGI_GPIO.DGI_GPIO2
EDBG_DGI_GPIO2_EN: U400.J1(PX03) ; port EDBG_DGI_GPIO2_EN
EDBG_DGI_GPIO3: U400.C9(PA11) ; port EDBG_DGI_GPIO.DGI_GPIO3
EDBG_DGI_GPIO3_EN: U400.H1(PX04) ; port EDBG_DGI_GPIO3_EN
EDBG_DGI_I2C_OE: U400.A2(PA27) ; port EDBG_DGI_I2C_OE
EDBG_DGI_SCL: U400.F7(PA26_/_PB05) ; port EDBG_DGI_I2C.SCL  [project net EDBG_DGI_I2C_SCL]
EDBG_DGI_SDA: U400.G7(PA12_/_PA25) ; port EDBG_DGI_I2C.SDA  [project net EDBG_DGI_I2C_SDA]
EDBG_DGI_SPI_MISO: U400.K2(PX27) ; port EDBG_DGI_SPI.MISO
EDBG_DGI_SPI_MOSI: U400.K3(PX28) ; port EDBG_DGI_SPI.MOSI
EDBG_DGI_SPI_OE: U400.H4(PX25) ; port EDBG_DGI_SPI_OE
EDBG_DGI_SPI_SCK: U400.J4(PX29) ; port EDBG_DGI_SPI.SCK
EDBG_DGI_SPI_SS: U400.G5(PX30) ; port EDBG_DGI_SPI.SS
EDBG_FORCE_BOOT: TP401.1 U400.H9(PA20_/_PX18)
EDBG_JTAG_TCK: TP402.1 U400.K9(TCK)
EDBG_JTAG_TDI: TP403.1 U400.K8(TDI)
EDBG_JTAG_TDO: TP404.1 U400.J8(TDO)
EDBG_JTAG_TMS: TP405.1 U400.H7(TMS)
EDBG_RESET_N: TP406.1 U400.J9(RESET_N)
EDBG_SWCLK: U400.D6(PB07) ; port EDBG_SWD.SWCLK
EDBG_SWD_SWCLK_OE: U400.B7(PC04) ; port EDBG_SWD_SWCLK_OE
EDBG_SWD_SWDIO_OE: U400.K1(PX23) ; port EDBG_SWD_SWDIO_OE
EDBG_SWDIO: U400.C5(PB09) ; port EDBG_SWD.SWDIO
EDBG_USB_FS_N: R421.2 U400.B9(DMFS)
EDBG_USB_FS_P: R422.2 U400.B8(DPFS)
EDBG_USB_HS_N: D402.3(I/O_2) J400.2(D-) R421.1 U400.A9(DMHS)
EDBG_USB_HS_P: D402.2(I/O_1) J400.3(D+) R422.1 U400.A8(DPHS)
ID1: R409.1 U400.A1(PA28) ; port ID_SYS.ID_1
ID2: R402.1 U400.B2(PB01) ; port ID_SYS.ID_2
ID3: R401.1 U400.B3(PB02) ; port ID_SYS.ID_3
POWER_LED_CTRL: Q400.2(G2) R410.1 U400.K4(PX15_/_PX32)
Shield: C403.2 J400.6(SHIELD1) J400.7(SHIELD2) J400.8(SHIELD3) J400.9(SHIELD4) R424.2
STATUS_LED_CTRL: Q400.5(G1) R413.2 U400.F1(PX19__/_PX59)
~{TARGET_VCC_ENABLE}: U400.J10(PA24_/_PX17) ; port ~{TARGET_VCC_ENABLE}
TARGET_RESET: U400.B4(PA29) ; port EDBG_SWD.TARGET_RESET
TARGET_RESET_SENSE_LEVEL: U400.H2(PX21) ; port TARGET_RESET_SENSE_LEVEL
XIN0: C400.1 U400.A5(PC02) XC400.1
XOUT0: C401.1 U400.A6(PC03) XC400.3
NetC402_1: C402.1 R423.2 U400.C7(USB_VBIAS)
NetC404_1: C404.1 L402.2 U400.J6(VDDANA)
NetC405_1: C405.1 C406.1 U400.E10(VDDCORE)
NetC407_1: C407.1 D402.4(VCC) J400.1(VBUS) L401.1
NetD400_1: D400.1(CATHODE) R411.2
NetD401_1: D401.1(CATHODE) R412.2
NetQ400_3: Q400.3(D1) R412.1
NetQ400_6: Q400.6(D2) R411.1

Not connected (* = marked no-connect by the designer): J400 4(ID)*; U400 A3(PB04)* A4(PA30)* A7(PC05)* B1(PB00)* C1(PB11)* C2(PA31)* C4(PB03)* C6(PB08)* D1(PX12)* D2(PX10)* D3(PX13)* D5(PB10)* D7(PB06)* E1(PA02_/_PX47)* E3(PX08)* E4(PX09)* E7(PA16)* E8(PA06_/_PA13)* F3(PX06)* F4(PX07)* G1(PX05)* G4(PX00)* G6(PA23_/_PX46)* G8(PA00_/_PA18)* G9(PA05)* G10(PA01_/_PA17)* H5(PX31)* H10(PA07_/_PA19)* J2(PX24)* J3(PX26)* J7(PA15_/_PX45)* K5(PC00_/_PX14)* K6(PC01)* K7(PA14_/_PX11)*; XC400 2* 4*

### Layout directives
differential pair; rule Assembly Testpoint Usage [Testpoint - Not Allowed    Multiple - Not Allowed]: EDBG_USB_HS_N, EDBG_USB_HS_P
rule Assembly Testpoint Usage [Testpoint - Not Allowed    Multiple - Not Allowed]: EDBG_USB_FS_N, EDBG_USB_FS_P, XIN0, XOUT0

### Notes on the sheet
- (near TP400) Connect the test points during startup of the EDBG to force it into bootloader mode.
  The test points should be covered with solder so that it is easier to get a good contact.
  The test points should be close together (preferrably on 2.54mm grid).
- UART RX and TX are switched here, and ONLY here!
- Input filter on USB power input.
- Programming interface of the embedded debugger. The test points will be connected by needles in the test fixture for programming. GND test point is TP400.
- Date:
- PAGE:
- of
- TITLE:
- Document number:
- Revision:

### Library data of the parts
C400 C401 = A01-0019: Ceramic capacitor, SMD 0402, NP0, 50V, +/-5%; PartGroup: Capacitors,Ceramic,SMD 0402; TemperatureRange: -55 - +125 deg C; AN: A01-0019; Tolerance: 50V, +/-5%; Height: 0,550000011920929
C402 = A01-0015: as C318 on sheet SAMC21_Xplained_Pro_Target_MCU; AN: A01-0015; Tolerance: 50V, +/-5%; Height: 0,550000011920929
C403 = A01-0046: Ceramic capacitor, SMD 0402, X7R, 25V, +/-10%; PartGroup: Capacitors,Ceramic,SMD 0402; TemperatureRange: -55 - +125 deg C; AN: A01-0046; Tolerance: 25V, +/-10%; Height: 0,550000011920929
C404 C410-C413 = A01-0246: as C304 on sheet SAMC21_Xplained_Pro_Target_MCU; AN: A01-0246; Tolerance: 16V, +/-10%; Height: 0,5
C405 C409 C414 C415 = A01-0300: Ceramic capacitor, SMD 0402, X5R, 6.3V, +/-20%; PartGroup: Capacitors,Ceramic,SMD 0402; Manufacturer: Kemet; MPN: C0402C225M9PAC; Tolerance: Â±20%; TemperatureRange: -55Â°C to +85Â°C; AN: A01-0300; Height: 0,5
C406-C408 = A01-0321: Ceramic capacitor, SMD 0402, C0G, 50V, +/-5%; PartGroup: Capacitors,Ceramic,SMD 0402; Manufacturer: Murata; MPN: GRM1555C1H102JA01D; Tolerance: 5%; AN: A01-0321; Height: 0,550000011920929
D400 = A10-0018: LED, Green, Wave length=575nm, SMD 0805, ±70°; PartGroup: Opto,LEDs,SMD; Manufacturer: Everlight; TemperatureRange: -40 - +85 deg C; AN: A10-0018; Height: 1,10000002384186; MPN: EL17-21SYGC
D401 = A10-0019: LED, Yellow, Wave length=591nm, SMD 0805, ±70°; PartGroup: Opto,LEDs,SMD; Manufacturer: Everlight; MPN: 17-21UYC/S530-A3/TR8; TemperatureRange: -40 to +85 deg C; AN: A10-0019; Height: 1,10000002384186
D402 = A06-0236: Double rail-to-rail USB ESD protection diode; Manufacturer: NXP; PartGroup: Integrated Circuits,Special function,Protection; TemperatureRange: -40 to +85 C; AN: A06-0236; PartType: Buy; Height: 1,10000002384186; MPN: PRTR5V0U2X
J400 = A08-2112: Micro USB AB Connector, Standard SMT + DIP; PartGroup: Mechanical devices,Connectors,USB; Manufacturer: HIROSE; AN: A08-2112; Height: 2,79999995231628; MPN: ZX62D-AB-5P8
L401 L402 = A03-0035: as L300 on sheet SAMC21_Xplained_Pro_Target_MCU; AN: A03-0035; Height: 0,800000011920929; MPN: BLM18PG471SN1
Q400 = A05-0051: Dual N-Channel MOSFET, 60V, 115mA cont,RDS(ON) < 7.5 Ohm @50mA@5V, SOT-363; PartGroup: Transistors,Small signal FET,SMD; Manufacturer: Fairchild; TemperatureRange: -65 to 150 deg C; AN: A05-0051; Height: 1,10000002384186; MPN: 2N7002DW
R401 R402 R409 = A02-0212: as R301 on sheet SAMC21_Xplained_Pro_Target_MCU; AN: A02-0212; Tolerance: 1 %; Height: 0,349999994039536
R410 R413 R424 = A02-0284: Thick film resistor, SMD 0402, 1/16W, 1%; PartGroup: Resistors,SMD,0402 1%; TemperatureRange: -55 - +125 deg C; AN: A02-0284; Tolerance: 1 %; Height: 0,349999994039536
R411 R412 = A02-0200: Thick film resistor, SMD 0402, 1/16W, 1%; PartGroup: Resistors,SMD,0402 1%; TemperatureRange: -55 - +125 deg C; AN: A02-0200; Tolerance: 1 %; Height: 0,349999994039536
R421 R422 = A02-0178: as R304 on sheet SAMC21_Xplained_Pro_Target_MCU; AN: A02-0178; Tolerance: 1 %; Height: 0,349999994039536
R423 = A02-0539: Thick film resistor, SMD 0402, 1/16W, 1%; PartGroup: Resistors,SMD,0402 1%; TemperatureRange: -55 - +125 deg C; AN: A02-0539; Tolerance: 1%; Height: 0,349999994039536
TP400-TP407 = A08-0004: as TP301 on sheet SAMC21_Xplained_Pro_Target_MCU; AN: A08-0004; Value: TESTPAD; Height: 0
U400 = A06-0736: AVR 32-bit RISC MCU; PartGroup: Integrated Circuits,MCU, MPU, DSP,AVR MCU; Manufacturer: ATMEL; TemperatureRange: -40 to +85 deg C; AN: A06-0736; Height: 1; MPN: AT32UC3A4256J-C1UR
XC400 = A07-0042: Fox FQ5032B 12.0MHz SMD crystal 738B-12; PartGroup: Frequency devices,Crystals,SMD; Manufacturer: Fox  Electronics; MPN: FQ5032B-12.000; Tolerance: Â±30ppm; TemperatureRange: 0Â°C ~ 70Â°C; AN: A07-0042; Height: 1,20000004768372

## Sheet SAMC21_Xplained_Pro_Connectors.SchDoc: Extension connectors
size A3; Organization: ATMEL Norway; Address1: Vestre Rosten 79; Address2: N-7075 TILLER; Address3: NORWAY; DocumentNumber: A09-2419; Revision: 5; SheetNumber: 3; SheetTotal: 9; PageSetup: Record=PageOptions|CenterHorizontal=True|CenterVertical=True|PrintScale=1.01|XCorrection=1.00|YCorrection=1.00|PrintKind=1|BorderSize=5000000|LeftOffset=0|BottomOffset=0|Orientation=2|PaperLength=1000|PaperWidth=1000|Scale=100|PaperSource=7|PrintQuality=-4|MediaType=1|DitherType=10|PaperKind=A3 (297 x 420 mm)|PrintScaleMode=1
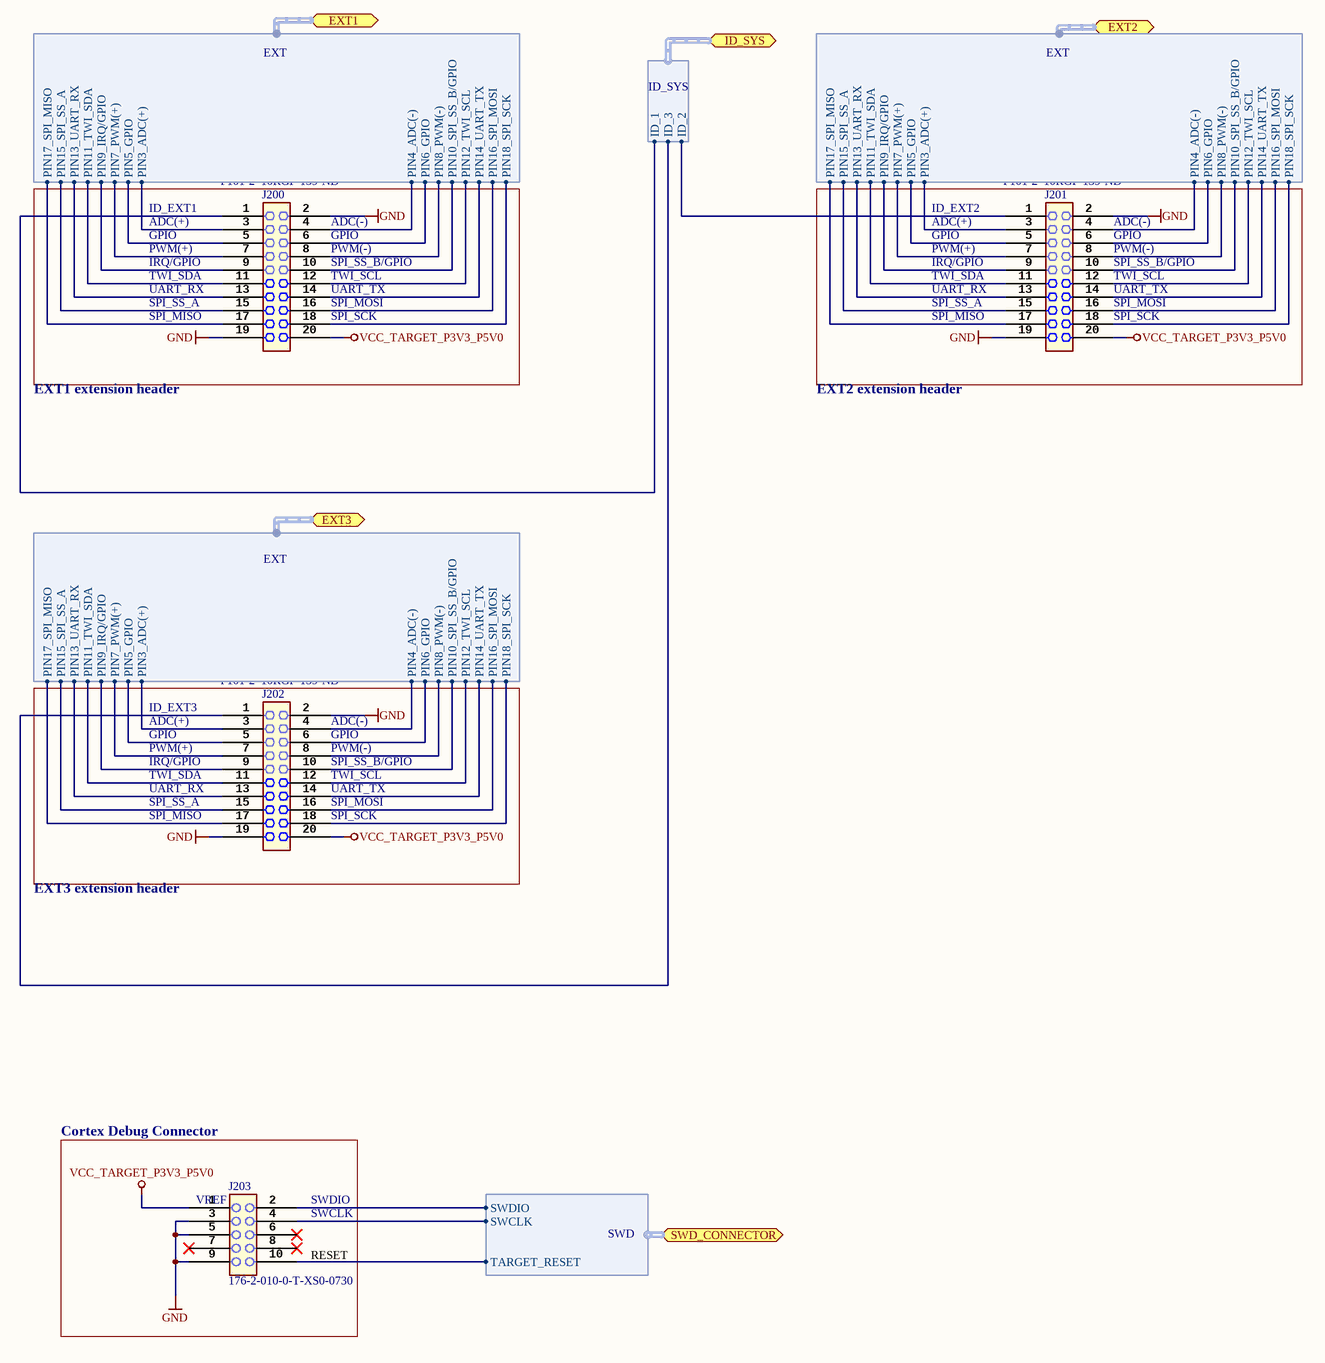
[diagram p3: SAMC21_Xplained_Pro_Connectors.SchDoc]

### Parts
J200  value P101-2*10RGF-139-ND  [AP8-00622]
J201  value P101-2*10RGF-139-ND  [AP8-00622]
J202  value P101-2*10RGF-139-ND  [AP8-00622]
J203  MPN: 176-2-010-0-T-XS0-0730  [AP8-00257]

### Blocks framed on the sheet
Cortex Debug Connector: J203

### Ports
EXT1 (harness EXT), EXT2 (harness EXT), EXT3 (harness EXT), ID_SYS (harness ID_SYS), SWD_CONNECTOR (harness SWD)

### Harnesses
ID_SYS: ID_1, ID_2, ID_3
EXT: PIN3_ADC(+), PIN4_ADC(-), PIN5_GPIO, PIN6_GPIO, PIN7_PWM(+), PIN8_PWM(-), PIN9_IRQ/GPIO, PIN10_SPI_SS_B/GPIO, PIN11_TWI_SDA, PIN12_TWI_SCL, PIN13_UART_RX, PIN14_UART_TX, PIN15_SPI_SS_A, PIN16_SPI_MOSI, PIN17_SPI_MISO, PIN18_SPI_SCK
SWD: SWCLK, SWDIO, TARGET_RESET

### Nets
GND: J200.2 J200.19 J201.2 J201.19 J202.2 J202.19 J203.3 J203.5 J203.9
VCC_TARGET_P3V3_P5V0: J200.20 J201.20 J202.20 J203.1
ID1: J200.1 ; port ID_SYS.ID_1
ID2: J201.1 ; port ID_SYS.ID_2
ID3: J202.1 ; port ID_SYS.ID_3
PA02_SPI_SS: J202.15 ; port EXT3.PIN15_SPI_SS_A
PA08_AIN10_X0: J201.3 ; port EXT2.PIN3_ADC(+)
PA09_AIN11_X1: J201.4 ; port EXT2.PIN4_ADC(-)
PA10_GPIO_X2: J201.5 ; port EXT2.PIN5_GPIO
PA11_GPIO_X3: J201.6 ; port EXT2.PIN6_GPIO
PA12_S2_I2C_SDA: J200.11 J201.11 J202.11 ; port EXT1.PIN11_TWI_SDA, port EXT3.PIN11_TWI_SDA, port EXT2.PIN11_TWI_SDA
PA13_S2_I2C_SCL: J200.12 J201.12 J202.12 ; port EXT1.PIN12_TWI_SCL, port EXT3.PIN12_TWI_SCL, port EXT2.PIN12_TWI_SCL
PA14_PWM_TC4_W0: J202.7 ; port EXT3.PIN7_PWM(+)
PA15_PWM_TC4_W1: J202.8 ; port EXT3.PIN8_PWM(-)
PA16_S1_SPI_MISO: J200.17 ; port EXT1.PIN17_SPI_MISO
PA17_S1_SPI_SS: J200.15 ; port EXT1.PIN15_SPI_SS_A
PA18_S1_SPI_MOSI_Y22: J200.16 ; port EXT1.PIN16_SPI_MOSI
PA19_S1_SPI_SCK_Y23: J200.18 ; port EXT1.PIN18_SPI_SCK
PA20_GPIO_RTS_TE_Y26: J200.5 ; port EXT1.PIN5_GPIO
PA21_GPIO_CTS_Y27: J200.6 ; port EXT1.PIN6_GPIO
PA22_S3_UART_TX: J200.14 J201.14 J202.14 ; port EXT1.PIN14_UART_TX, port EXT3.PIN14_UART_TX, port EXT2.PIN14_UART_TX
PA23_S3_UART_RX: J200.13 J201.13 J202.13 ; port EXT1.PIN13_UART_RX, port EXT3.PIN13_UART_RX, port EXT2.PIN13_UART_RX
PA27_GPIO_SS: J202.10 ; port EXT3.PIN10_SPI_SS_B/GPIO
PA28_GPIO_IRQ8: J202.9 ; port EXT3.PIN9_IRQ/GPIO
PA30_SWCLK: J203.4 ; port SWD_CONNECTOR.SWCLK
PA31_SWDIO: J203.2 ; port SWD_CONNECTOR.SWDIO
PB00_S5_SPI_MOSI: J201.16 J202.16 ; port EXT3.PIN16_SPI_MOSI, port EXT2.PIN16_SPI_MOSI
PB01_S5_SPI_SCK: J201.18 J202.18 ; port EXT3.PIN18_SPI_SCK, port EXT2.PIN18_SPI_SCK
PB02_S5_SPI_MISO: J201.17 J202.17 ; port EXT3.PIN17_SPI_MISO, port EXT2.PIN17_SPI_MISO
PB03_S5_SPI_SS: J201.15 ; port EXT2.PIN15_SPI_SS_A
PB04_GPIO: J202.5 ; port EXT3.PIN5_GPIO
PB05_GPIO: J202.6 ; port EXT3.PIN6_GPIO
PB06_AIN8_INN2: J202.4 ; port EXT3.PIN4_ADC(-)
PB07_AIN9_INP2: J202.3 ; port EXT3.PIN3_ADC(+)
PB08_INN1_Y14: J200.4 ; port EXT1.PIN4_ADC(-)
PB09_INP1_Y15: J200.3 ; port EXT1.PIN3_ADC(+)
PB12_PWM_TC0_W0: J200.7 ; port EXT1.PIN7_PWM(+)
PB13_PWM_TC0_W1: J200.8 ; port EXT1.PIN8_PWM(-)
PB14_GPIO_IRQ14_Y30: J200.9 ; port EXT1.PIN9_IRQ/GPIO
PB15_GPIO_SS_Y31: J200.10 ; port EXT1.PIN10_SPI_SS_B/GPIO
PB16_GPIO_IRQ0: J201.9 ; port EXT2.PIN9_IRQ/GPIO
PB17_GPIO_SS: J201.10 ; port EXT2.PIN10_SPI_SS_B/GPIO
PB30_PWM_TCC0_W0: J201.7 ; port EXT2.PIN7_PWM(+)
PB31_PWM_TCC0_W1: J201.8 ; port EXT2.PIN8_PWM(-)
TARGET_RESET_CON: J203.10 ; port SWD_CONNECTOR.TARGET_RESET

Not connected (* = marked no-connect by the designer): J203 6* 7* 8*

### Notes on the sheet
- ID_EXT1
- ID_EXT2
- ADC(+)
- GPIO
- PWM(+)
- IRQ/GPIO
- TWI_SDA
- UART_RX
- (near J200) ADC(-)
- (near J200) GPIO
- (near J200) PWM(-)
- (near J200) SPI_SS_B/GPIO
- (near J200) TWI_SCL
- (near J200) UART_TX
- (near J201) ADC(-)
- (near J201) GPIO
- (near J201) PWM(-)
- (near J201) SPI_SS_B/GPIO
- (near J201) TWI_SCL
- (near J201) UART_TX
- SPI_SS_A
- SPI_MISO
- (near J200) SPI_MOSI
- (near J200) SPI_SCK
- (near J201) SPI_MOSI
- (near J201) SPI_SCK
- EXT1 extension header
- EXT2 extension header
- ID_EXT3
- (near J202) ADC(-)
- (near J202) GPIO
- (near J202) PWM(-)
- (near J202) SPI_SS_B/GPIO
- (near J202) TWI_SCL
- (near J202) UART_TX
- (near J202) SPI_MOSI
- (near J202) SPI_SCK
- EXT3 extension header
- (near J203) VREF
- SWDIO
- SWCLK
- RESET
- Date:
- PAGE:
- of
- TITLE:
- Document number:
- Revision:

### Library data of the parts
J200-J202 = A08-1513: Pin header, 2x10, Right Angle, 2.54mm, THM, Pin In Paste; PartGroup: Mechanical devices,Connectors,Pin headers; Manufacturer: Pro-data International Corp; AN: A08-1513; MPN: P101-2*10RGF-139-ND
J203 = A08-0385: 2x5 pin header, 1.27mm pitch, THM; PartGroup: Mechanical devices,Connectors,Pin headers; Manufacturer: Garry; Value: PIN HEADER 2x5; AN: A08-0385; Height: 7,30000019073486

## Sheet SAMC21_Xplained_Pro_dual_input_power_supply.SchDoc: Power supply
size A3; Organization: ATMEL Norway; Address1: Vestre Rosten 79; Address2: N-7075 TILLER; Address3: NORWAY; DocumentNumber: A09-2419; Revision: 5; SheetNumber: 2; SheetTotal: 9; PageSetup: Record=PageOptions|CenterHorizontal=True|CenterVertical=True|PrintScale=0.71|XCorrection=1.00|YCorrection=1.00|PrintKind=0|BorderSize=5000000|LeftOffset=0|BottomOffset=0|Orientation=2|PaperLength=1000|PaperWidth=1000|Scale=100|PaperSource=15|PrintQuality=600|MediaType=1|DitherType=10|PrintScaleMode=1|PaperKind=A4 (210 x 297 mm)|PaperIndex=9
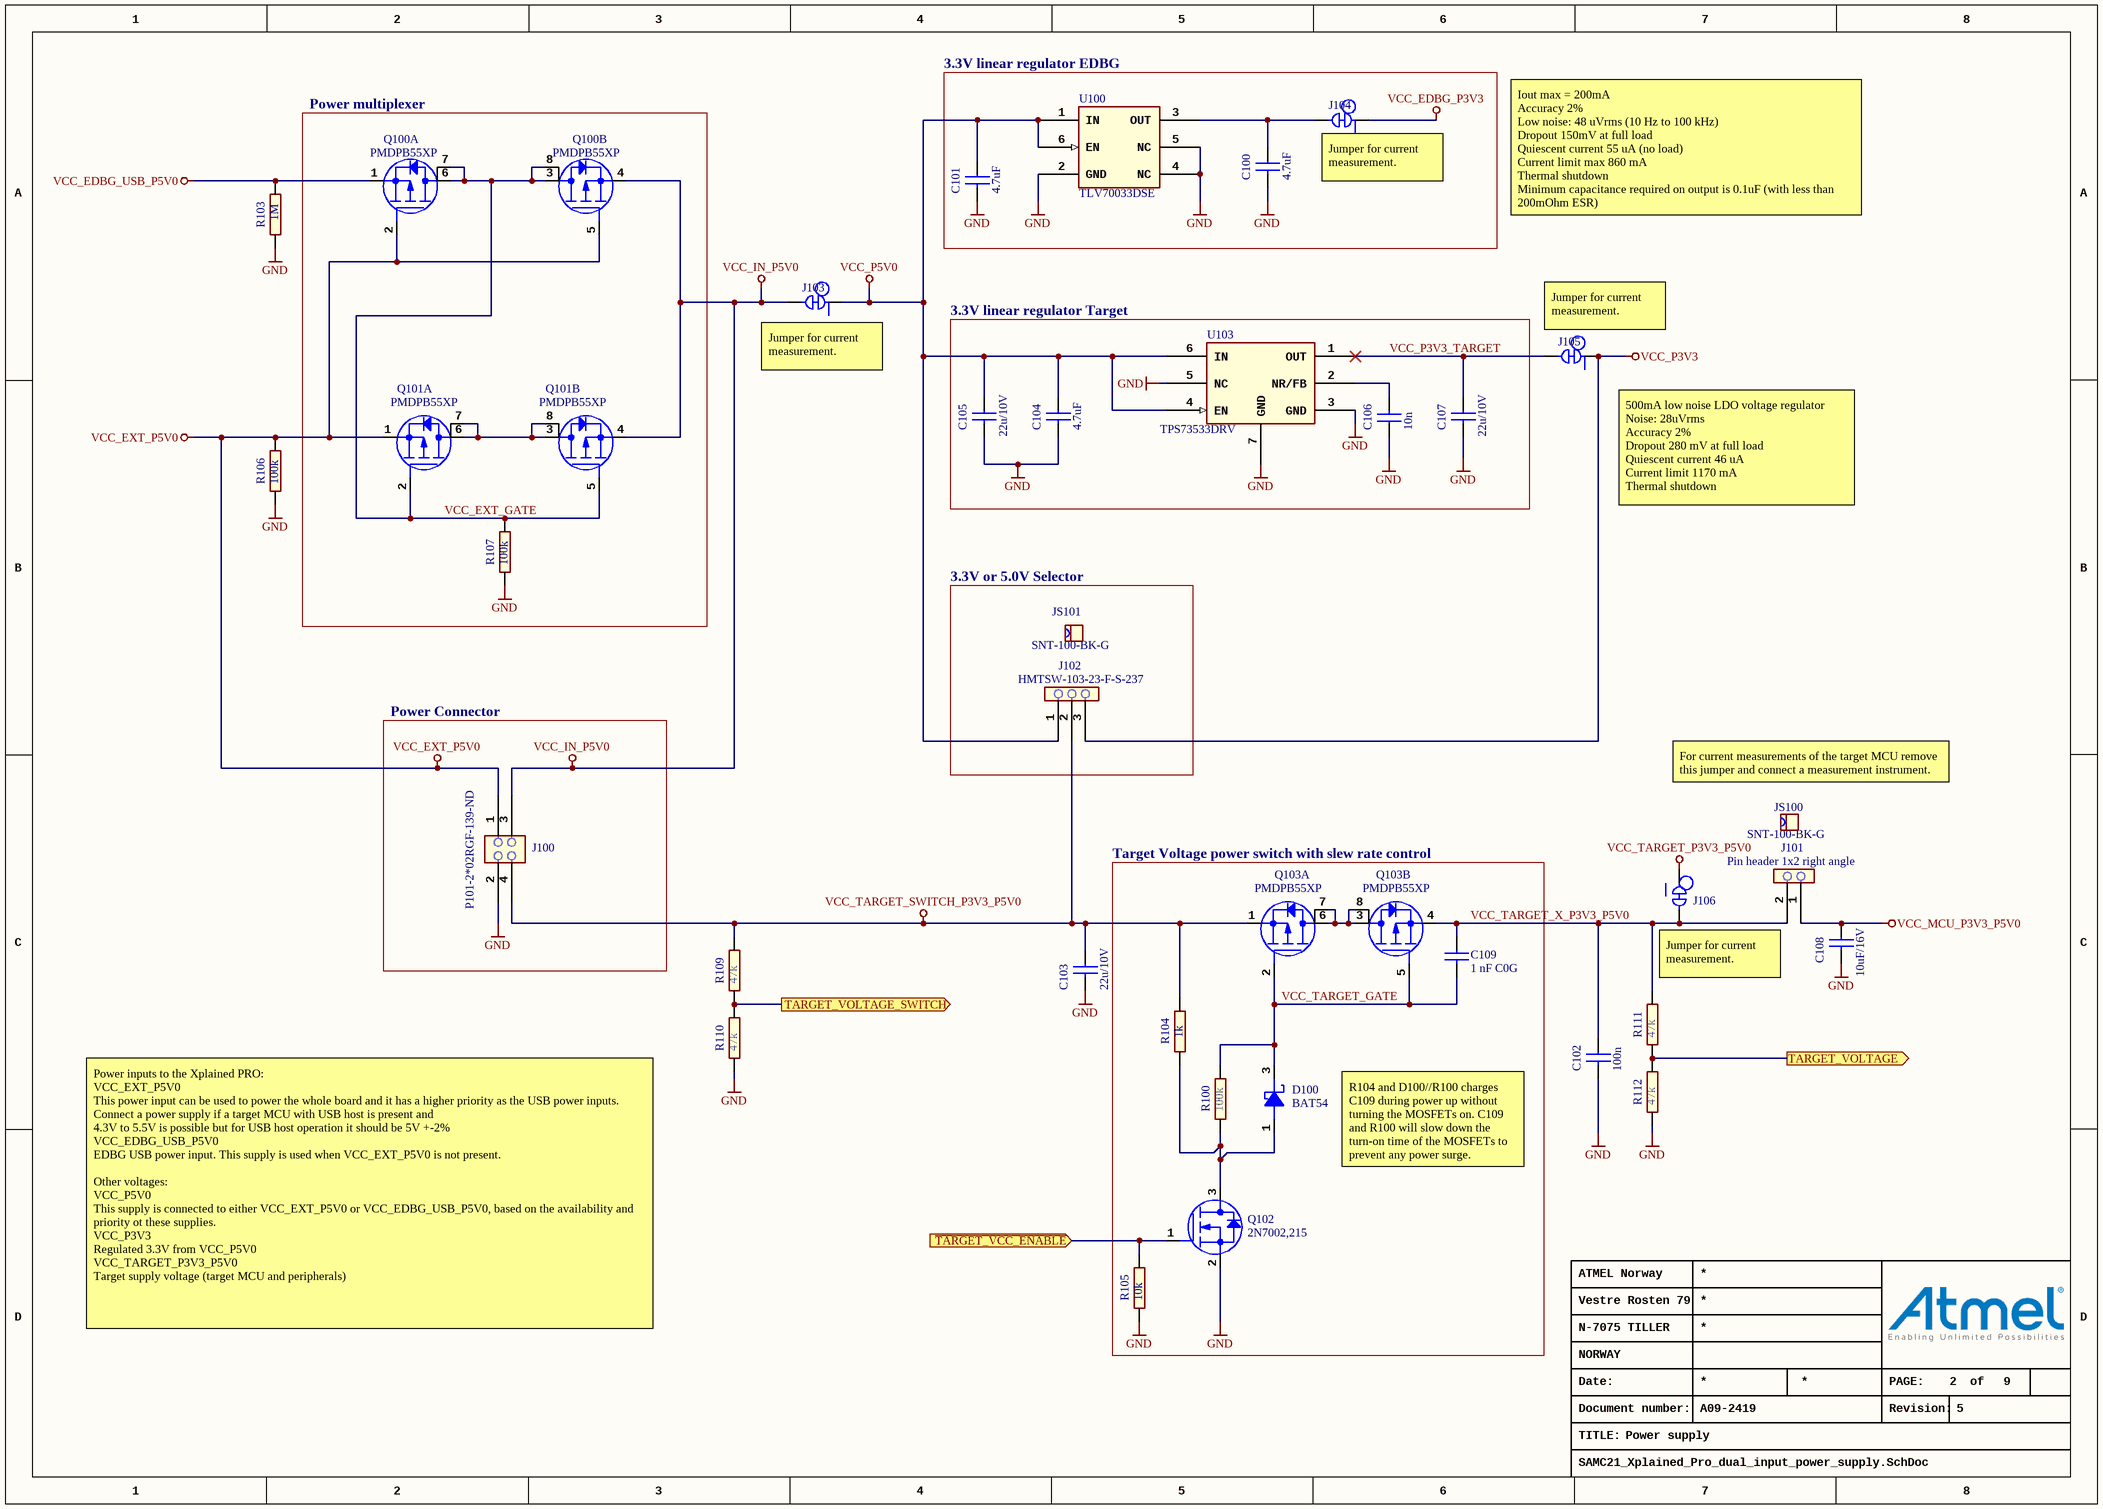
[diagram p4: SAMC21_Xplained_Pro_dual_input_power_supply.SchDoc]

### Parts
C100  value 4.7uF  [AP1-00117]
C101  value 4.7uF  [AP1-00117]
C102  value 100n  [AP1-00001]
C103  value 22u/10V  [AP1-00003]
C104  value 4.7uF  [AP1-00117]
C105  value 22u/10V  [AP1-00003]
C106  value 10n  [AP1-00053]
C107  value 22u/10V  [AP1-00003]
C108  value 10uF/16V  [AP1-00039]
C109  value 1 nF C0G  [AP1-00053]
D100  value BAT54  [AP4-00007]
J100  value P101-2*02RGF-139-ND  [AP8-00628]
J101  value Pin header 1x2 right angle  [AP8-00367]
J102  value HMTSW-103-23-F-S-237  [AP8-00745]
J103  (no value)  [AP9-00044]  (net tie, no BOM)
J104  (no value)  [AP9-00044]  (net tie, no BOM)
J105  (no value)  [AP9-00044]  (net tie, no BOM)
J106  (no value)  [AP9-00044]  (net tie, no BOM)
JS100  value SNT-100-BK-G  [AP8-00525]
JS101  value SNT-100-BK-G  [AP8-00525]
Q100  value PMDPB55XP  [AP5-00047]  (hidden comment: Farnell order code: 2191806)  (parts A,B of 2)
Q101  value PMDPB55XP  [AP5-00047]  (hidden comment: Farnell order code: 2191806)  (parts A,B of 2)
Q102  value 2N7002,215  [AP5-00002]
Q103  value PMDPB55XP  [AP5-00047]  (hidden comment: Farnell order code: 2191806)  (parts A,B of 2)
R100  value 100k  [AP2-00000]
R103  value 1M  [AP2-00000]
R104  value 1k  [AP2-00000]
R105  value 10k  [AP2-00000]
R106  value 100k  [AP2-00000]
R107  value 100k  [AP2-00000]
R109  value 47k  [AP2-00000]
R110  value 47k  [AP2-00000]
R111  value 47k  [AP2-00000]
R112  value 47k  [AP2-00000]
U100  value TLV70033DSE  [AP6-00262]
U103  value TPS73533DRV  [AP6-00162]

### Blocks framed on the sheet
Power multiplexer: Q100 Q101 R107
3.3V linear regulator EDBG: C100 C101 J104 U100
3.3V linear regulator Target: C104-C107 U103
3.3V or 5.0V Selector: J102 JS101
Power Connector: J100
Target Voltage power switch with slew rate control: C109 D100 Q102 Q103 R100 R104 R105

### Ports
TARGET_VOLTAGE (out), TARGET_VOLTAGE_SWITCH (out), ~{TARGET_VCC_ENABLE} (in)

### Nets
GND: C100.2 C101.2 C102.2 C103.2 C104.2 C105.2 C106.1 C107.2 C108.2 J100.2 Q102.2(S) R103.1 R105.1 R106.1 R107.1 R110.1 R112.1 U100.2(GND) U100.4(NC) U100.5(NC) U103.3(GND) U103.5(NC) U103.7(GND)
VCC_EDBG_P3V3: J104.1
VCC_EDBG_USB_P5V0: Q100.1(S1) R103.2
VCC_EXT_P5V0: J100.1 Q100.2(G1) Q100.5(G2) Q101.1(S1) R106.2
VCC_IN_P5V0: J100.3 J103.2 Q100.4(S2) Q101.4(S2)
VCC_MCU_P3V3_P5V0: C108.1 J101.1
VCC_P3V3: J102.3 J105.1
VCC_P5V0: C101.1 C104.1 C105.1 J102.1 J103.1 U100.1(IN) U100.6(EN) U103.4(EN) U103.6(IN)
VCC_TARGET_P3V3_P5V0: J106.1
VCC_TARGET_SWITCH_P3V3_P5V0: C103.1 J100.4 J102.2 Q103.1(S1) R104.2 R109.2
EDBG_ADC0: R111.1 R112.2 ; port TARGET_VOLTAGE
EDBG_ADC1: R109.1 R110.2 ; port TARGET_VOLTAGE_SWITCH
~{TARGET_VCC_ENABLE}: Q102.1(G) R105.2 ; port ~{TARGET_VCC_ENABLE}
VCC_EXT_GATE: Q100.3(D2) Q100.6(D1) Q100.7(D1_PAD) Q100.8(D2_PAD) Q101.2(G1) Q101.5(G2) R107.2
VCC_P3V3_TARGET: C107.1 J105.2 U103.1(OUT)
VCC_TARGET_GATE: C109.2 D100.3(CATHODE) Q103.2(G1) Q103.5(G2) R100.2
VCC_TARGET_X_P3V3_P5V0: C102.1 C109.1 J101.2 J106.2 Q103.4(S2) R111.2
NetC100_1: C100.1 J104.2 U100.3(OUT)
NetC106_2: C106.2 U103.2(NR/FB)
NetD100_1: D100.1(ANODE) Q102.3(D) R100.1 R104.1
NetQ101_3: Q101.3(D2) Q101.6(D1) Q101.7(D1_PAD) Q101.8(D2_PAD)
NetQ103_3: Q103.3(D2) Q103.6(D1) Q103.7(D1_PAD) Q103.8(D2_PAD)

### Notes on the sheet
- (near J104) Jumper for current measurement.
- Iout max = 200mA
  Accuracy 2%
  Low noise: 48 uVrms (10 Hz to 100 kHz)
  Dropout 150mV at full load
  Quiescent current 55 uA (no load)
  Current limit max 860 mA
  Thermal shutdown
  Minimum capacitance required on output is 0.1uF (with less than 200mOhm ESR)
- (near J103) Jumper for current measurement.
- (near J105) Jumper for current measurement.
- (near J105) 500mA low noise LDO voltage regulator
  Noise: 28uVrms
  Accuracy 2%
  Dropout 280 mV at full load
  Quiescent current 46 uA
  Current limit 1170 mA
  Thermal shutdown
- For current measurements of the target MCU remove this jumper and connect a measurement instrument.
- Jumper for current measurement.
- R104 and D100//R100 charges C109 during power up without turning the MOSFETs on. C109 and R100 will slow down the turn-on time of the MOSFETs to prevent any power surge.
- Power inputs to the Xplained PRO:
  VCC_EXT_P5V0
  This power input can be used to power the whole board and it has a higher priority as the USB power inputs. Connect a power supply if a target MCU with USB host is present and
  4.3V to 5.5V is possible but for USB host operation it should be 5V +-2%
  VCC_EDBG_USB_P5V0
  EDBG USB power input. This supply is used when VCC_EXT_P5V0 is not present.
  Other voltages:
  VCC_P5V0
  This supply is connected to either VCC_EXT_P5V0 or VCC_EDBG_USB_P5V0, based on the availability and priority ot these supplies.
  VCC_P3V3
  Regulated 3.3V from VCC_P5V0
  VCC_TARGET_P3V3_P5V0
  Target supply voltage (target MCU and peripherals)
- Date:
- PAGE:
- of
- TITLE:
- Document number:
- Revision:

### Library data of the parts
C100 C101 C104 = A01-0377: Ceramic capacitor, SMD 0603, X5R, 10V, 10% (de31036); PartGroup: Capacitors,Ceramic,SMD 0603; Manufacturer: tdk; MPN: C1608X5R1A475K; TemperatureRange: -55 - +85 deg C; AN: A01-0377; Tolerance: 10%; Height: 0,800000011920929
C102 = A01-0246: as C304 on sheet SAMC21_Xplained_Pro_Target_MCU; AN: A01-0246; Tolerance: 16V, +/-10%; Height: 0,5
C103 C105 C107 = A01-0500: Ceramic capacitor, SMD 0805, X5R, 10V, Â±20%; PartGroup: Capacitors,Ceramic,SMD 0805; Manufacturer: tdk; MPN: C2012X5R1A226M/0.85; TemperatureRange: -55Â°C to +85Â°C; AN: A01-0500; Height: 0,949999988079071
C106 = A01-0050: Ceramic capacitor, SMD 0402, X7R, 25V, +/-10%; PartGroup: Capacitors,Ceramic,SMD 0402; TemperatureRange: -55 - +125 deg C; AN: A01-0050; Tolerance: 25V, +/-10%; Height: 0,550000011920929
C108 = A01-0491: Ceramic capacitor, SMD 0603, X5R, 16V, 10UF ± 20% (High Density); PartGroup: Capacitors,Ceramic,SMD 0603; Manufacturer: Taiyo Yuden; MPN: EMK107BBJ106MA-T; Tolerance: ­± 20%; TemperatureRange: -55°C to +85°C; AN: A01-0491; Height: 0,819999992847443
C109 = A01-0321: as C406 on sheet SAMC21_Xplained_Pro_EDBG; AN: A01-0321; Height: 0,550000011920929
D100 = A04-0001: Schottky diode, V(rrm)=30V, I(f)=0.1A, V(f)=0.4V (at If = 0.01A), I(r)=0.5uA (at Vrrm), t(rr)=5ns, SMD SOT23; PartGroup: Diodes,Schottky; Manufacturer: Philips; NC: 2; TemperatureRange: -40 - +85 deg C; AN: A04-0001; Height: 1,10000002384186; MPN: BAT54
J100 = A08-1519: Pin header, 2x2, Right Angle, 2.54mm, THT, Pin In Paste; PartGroup: Mechanical devices,Connectors,Pin headers; Manufacturer: Pro-data International Corp; AN: A08-1519; Height: 5,07999992370605; MPN: P101-2*02RGF-139-ND
J101 = A08-0764: 1x2 pin header, right angle, 2.54 mm pitch, through-hole; PartGroup: Mechanical devices,Connectors,Pin headers; Manufacturer: Pro-data International Corp; MPN: 2213R-2G; AN: A08-0764; Height: 2,53999996185303
J102 = A08-1799: 1x3 pin header, 2.54mm pitch, Pin-in-Paste THM, 1mm hole; PartGroup: Mechanical devices,Connectors,Pin headers; Manufacturer: SAMTEC; AN: A08-1799; Height: 6,09999990463257; MPN: HMTSW-103-23-F-S-237
J103-J106 = A09-0783: as J300 on sheet SAMC21_Xplained_Pro_Target_MCU; AN: A09-0783; Height: 0
JS100 JS101 = A08-0543: Jumper cap for 2.54mm pinheader; PartGroup: Mechanical devices,Mounting accessories,Other; Manufacturer: SAMTEC; AN: A08-0543; MPN: SNT-100-BK-G
Q100 Q101 Q103 = A05-0146: Dual P-Channel MOSFET, -20V, RDS(ON) < 55 mOhm @-3.4A@-4.5V; PartGroup: Transistors,Power FET,SMD; Manufacturer: NXP; TemperatureRange: -55Â°C to 150Â°C; AN: A05-0146; Height: 0,649999976158142; MPN: PMDPB55XP
Q102 = A05-0085: N-Channel MOSFET. 60V, 0.300A continuous, 1.2A Peak. RDS(ON) = 3.8Ohm@VGS=4.5V, VGS(th)<2.5V; PartGroup: Transistors,Small signal FET,SMD; Manufacturer: NXP; TemperatureRange: -65 to 150 deg C; AN: A05-0085; Height: 1,10000002384186; MPN: 2N7002,215
R100 R106 R107 = A02-0260: as R300 on sheet SAMC21_Xplained_Pro_Target_MCU; AN: A02-0260; Tolerance: 1 %; Height: 0,349999994039536
R103 = A02-0284: as R410 on sheet SAMC21_Xplained_Pro_EDBG; AN: A02-0284; Tolerance: 1 %; Height: 0,349999994039536
R104 = A02-0212: as R301 on sheet SAMC21_Xplained_Pro_Target_MCU; AN: A02-0212; Tolerance: 1 %; Height: 0,349999994039536
R105 = A02-0236: Thick film resistor, SMD 0402, 1/16W, 1%; PartGroup: Resistors,SMD,0402 1%; Manufacturer: vishay; MPN: CRCW040210K0FKED; TemperatureRange: -55 - +125 deg C; AN: A02-0236; Tolerance: 1 %; Height: 0,349999994039536
R109-R112 = A02-0252: Thick film resistor, SMD 0402, 1/16W, 1%; PartGroup: Resistors,SMD,0402 1%; TemperatureRange: -55 - +125 deg C; AN: A02-0252; Tolerance: 1 %; Height: 0,349999994039536
U100 = A06-0719: LDO, 200 mA, Iq=31 uA, Vdo=250mV, Vout=3.3V, VIN= 2 V to 5.5V, SON-6 package; PartGroup: Integrated Circuits,Regulators,Linear; Manufacturer: Texas Instruments; AN: A06-0719; Height: 0,800000011920929; MPN: TLV70033DSE
U103 = A06-1135: Low noise LDO, 500 mA, Vout=3.3V, 2% accuracy, IQ=46uA, noise=28uVrms, VIN= 2.7V to 6.5V, Vdo=280mV,stable with low ESR capacitor; PartGroup: Integrated Circuits,Regulators,Linear; Manufacturer: Texas Instruments; AN: A06-1135; Height: 0,75; MPN: TPS73533DRV